# EasyEDA Pro project CameraTargetV1.eprj, board PCB1
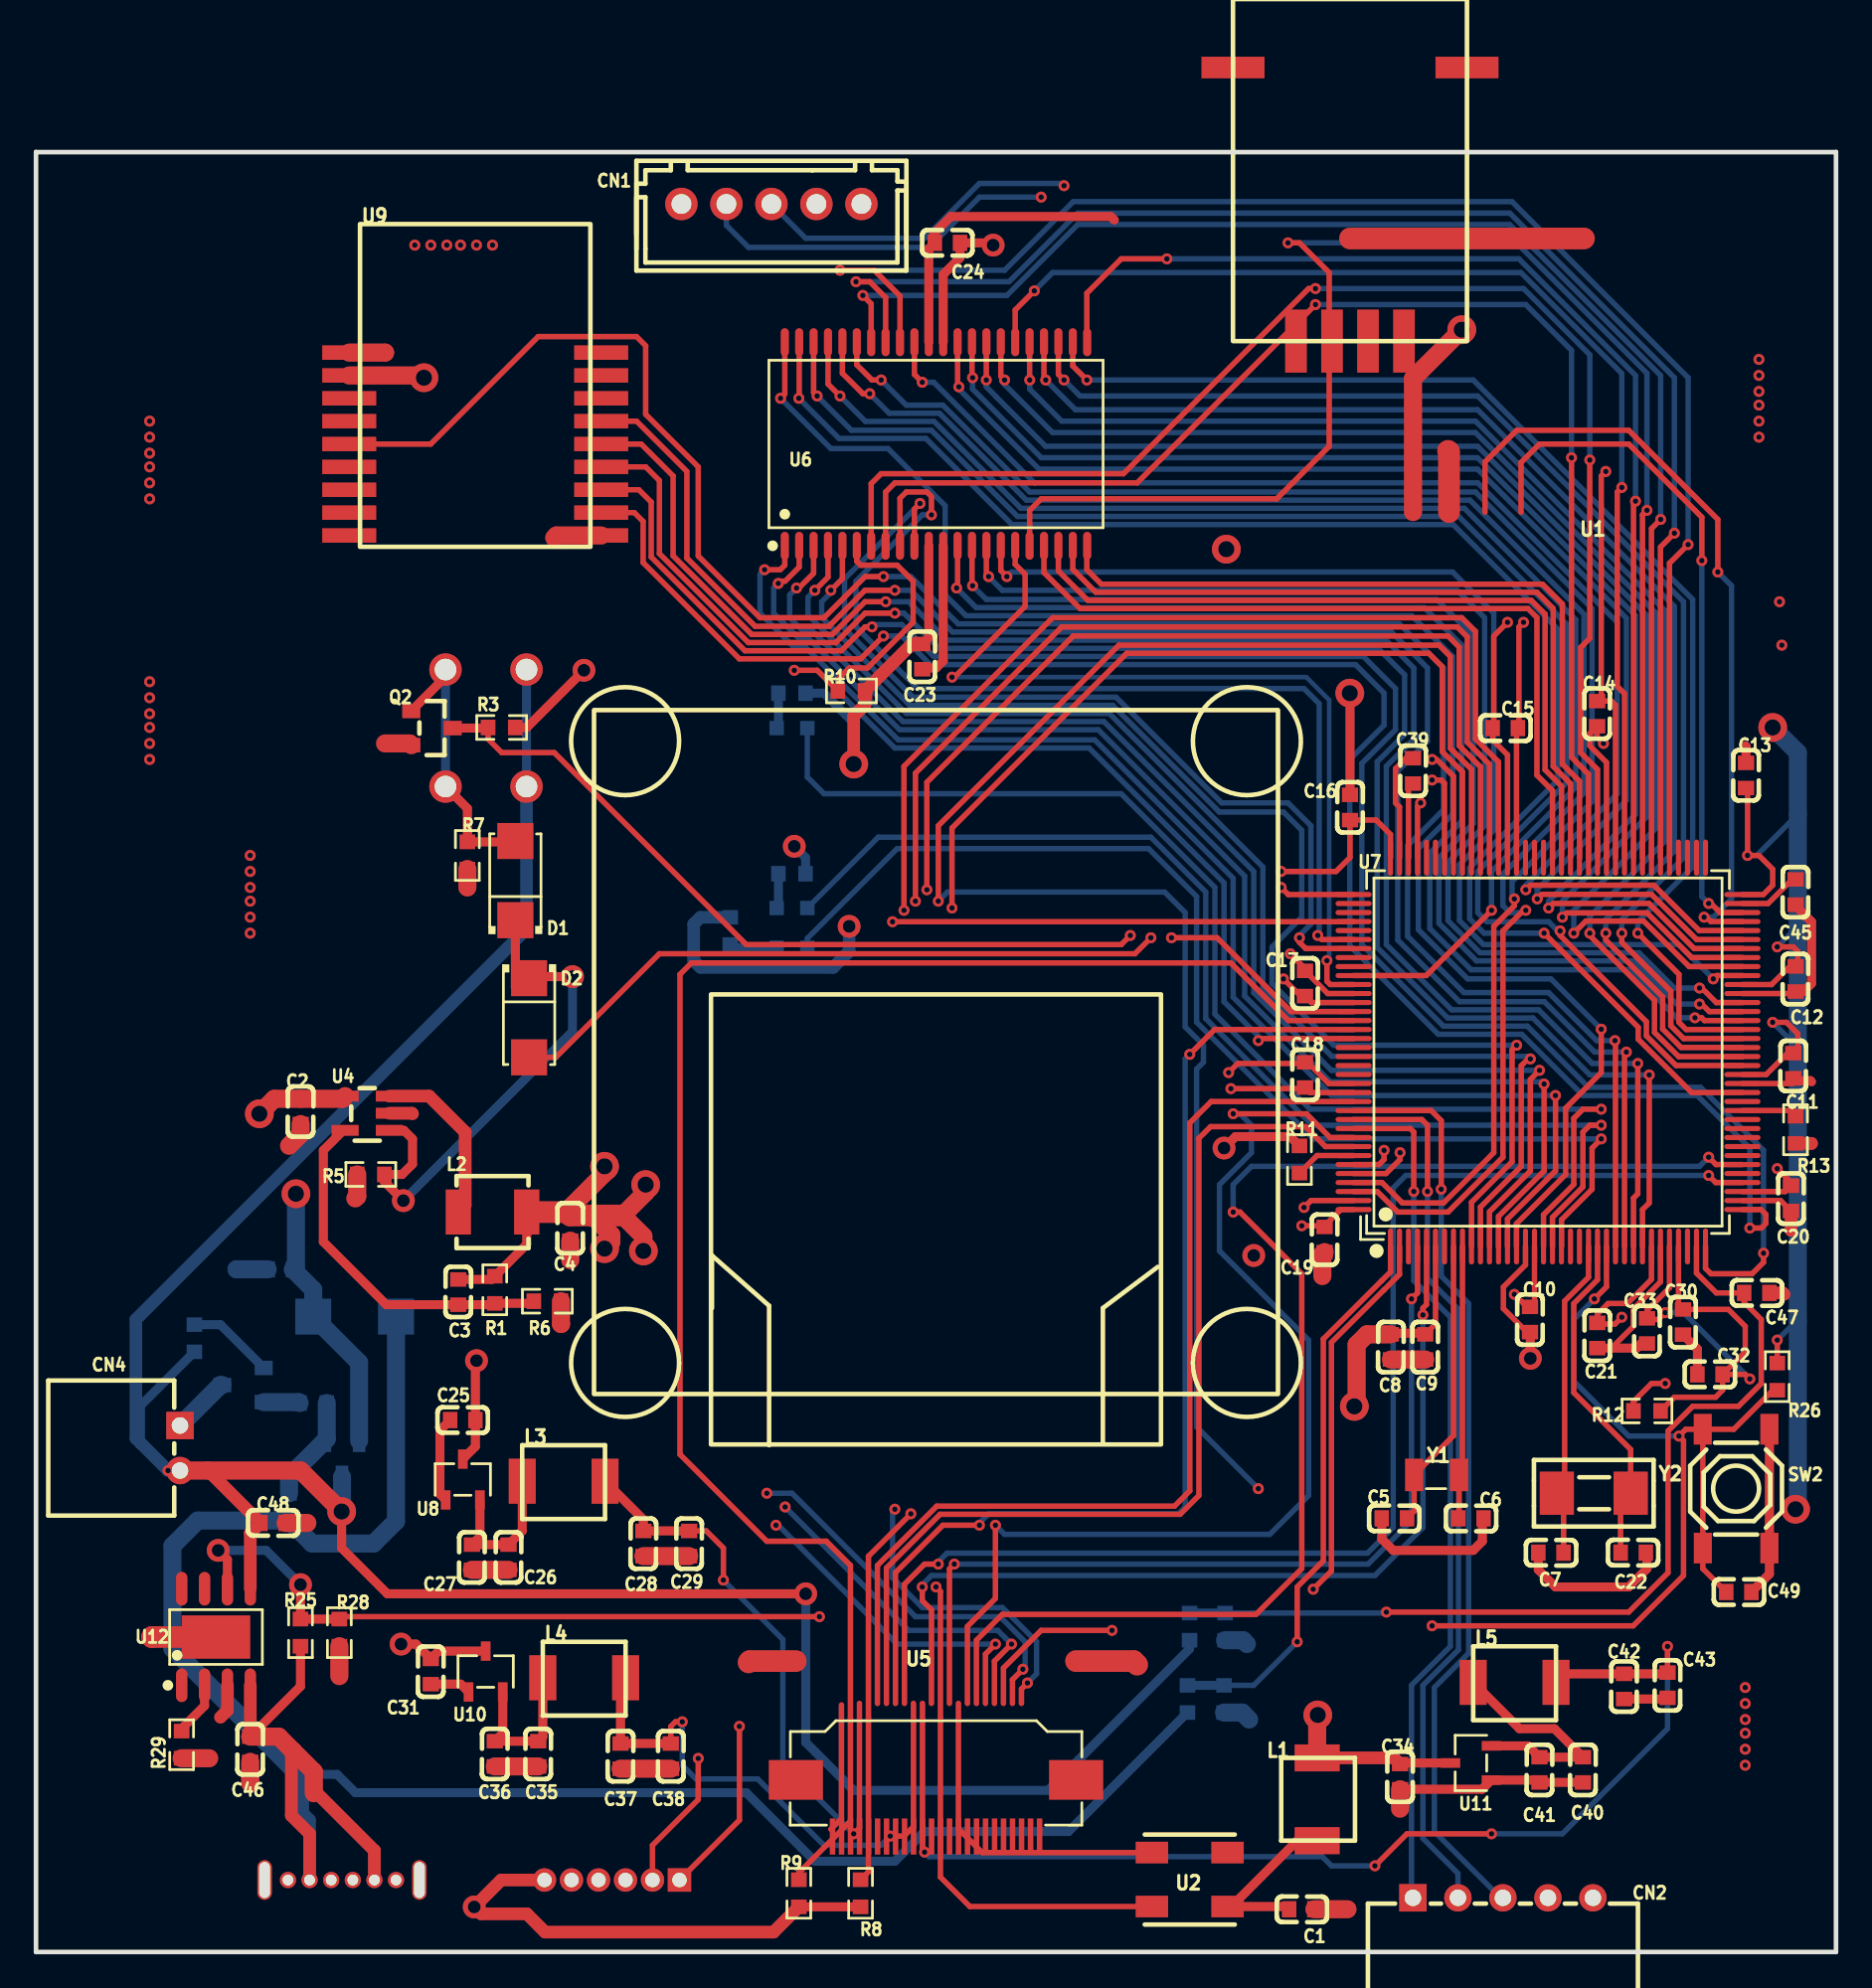
[diagram p1: board, top side]
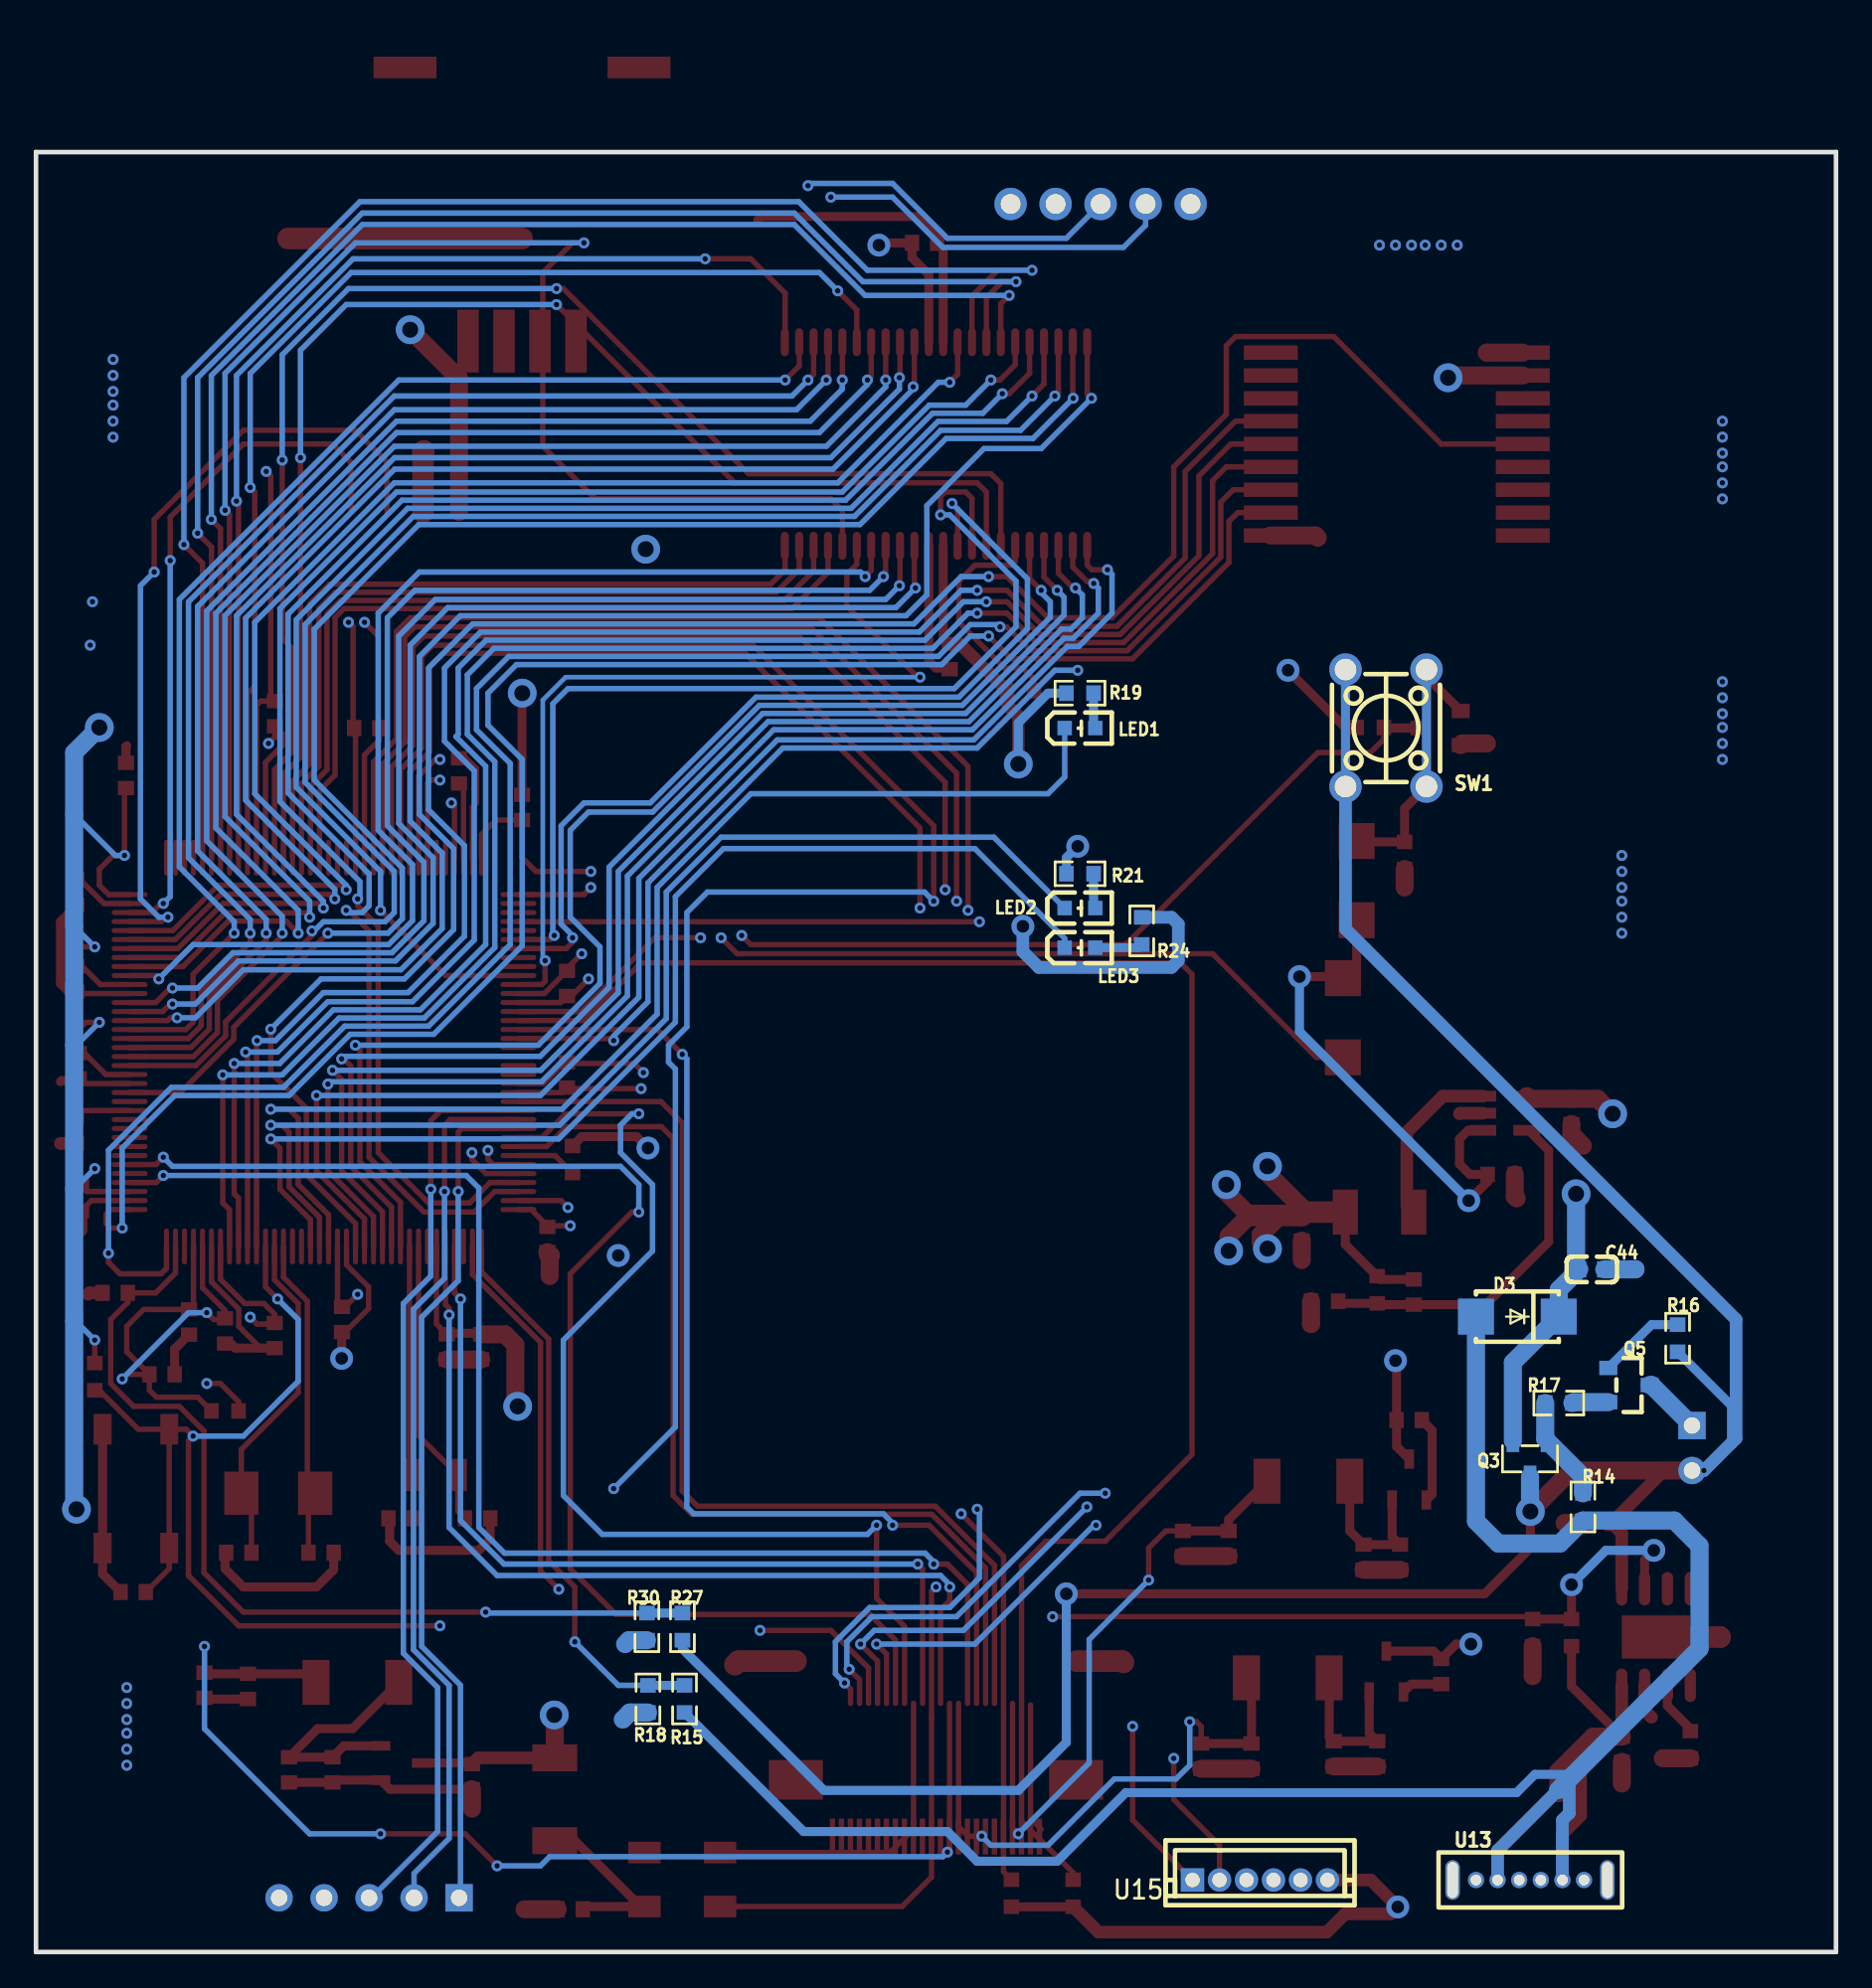
[diagram p2: board, bottom side, seen from below]

Outline 100 x 100 mm; copper layers: Top Layer, CPU1, CPU2, Bottom Layer. Coordinates in mm from the lower left corner of the outline.
Outline path: 0,100 0,0 arc(0,0) 0,0 100,0 arc(100,0) 100,0 100,100 arc(100,100) 100,100 0,100 arc(0,100) 0,100
Stack: Top Layer 0.035mm / Dielectric1 0.48mm PP er 4.5 / CPU1 0.035mm / Dielectric2 0.48mm FR4 er 4.5 / CPU2 0.035mm / Dielectric3 0.48mm PP er 4.5 / Bottom Layer 0.035mm

## Design rules (mm)
spacing safeClearance (default): track to track 0.152, other pairs 0.152 to 0.3
track width trackWidth (default): min 0.127, default 0.254, max 2.54
differential pair differentialPair (default): width min 0.127, default 0.254, max 2.54; gap min 0.152, default 0.152
via viaSize (default): diameter min 0.5, default 0.61, max 10; hole min 0.3, default 0.305, max 6

## Placement (name value [footprint] x y rotation side)
C1  0.1uF  [C0603]  70.32 2.38 180 top
C2  10uF  [C0603]  14.7 46.7 90 top
C3  22pF  [C0603]  23.46 36.67 270 top
C4  10uF  [C0603]  29.68 40.22 90 top
C5  15pF  [C0603]  75.47 24.09 0 top
C6  15pF  [C0603]  79.72 24.09 180 top
C7  22pF  [C0603]  84.16 22.19 180 top
C8  10uF  [C0603]  75.27 33.62 90 top
C9  0.1uF  [C0603]  77.18 33.62 90 top
C10  0.1uF  [C0603]  83 35.14 90 top
C11  0.1uF  [C0603]  97.63 49.24 90 top
C12  0.1uF  [C0603]  97.75 54.06 90 top
C13  0.1uF  [C0603]  95 65.37 270 top
C14  0.1uF  [C0603]  86.73 68.8 270 top
C15  0.1uF  [C0603]  81.63 68 180 top
C16  0.1uF  [C0603]  73 63.59 270 top
C17  0.1uF  [C0603]  70.5 53.81 270 top
C18  0.1uF  [C0603]  70.5 48.73 270 top
C19  0.1uF  [C0603]  71.59 39.59 90 top
C20  0.1uF  [C0603]  97.5 41.87 90 top
C21  0.1uF  [C0603]  86.74 34.25 90 top
C22  22pF  [C0603]  88.74 22.19 0 top
C23  0.1uF  [C0603]  49.24 71.97 90 top
C24  0.1uF  [C0603]  50.64 94.96 0 top
C25  1uF  [C0603]  23.71 29.55 0 top
C26  0.1uF  [C0603]  26.25 21.93 90 top
C27  10uF  [C0603]  24.22 21.93 90 top
C28  10uF  [C0603]  33.74 22.7 90 top
C29  0.1uF  [C0603]  36.28 22.7 90 top
C30  0.1uF  [C0603]  91.5 35 90 top
C31  1uF  [C0603]  21.93 15.58 90 top
C32  10uF  [C0603]  93 32.09 0 top
C33  2.2uF  [C0603]  89.5 34.51 90 top
C34  1uF  [C0603]  75.78 9.74 90 top
C35  0.1uF  [C0603]  27.9 11.01 90 top
C36  10uF  [C0603]  25.49 11.01 90 top
C37  10uF  [C0603]  32.47 10.88 90 top
C38  0.1uF  [C0603]  35.27 10.88 90 top
C39  2.2uF  [C0603]  76.5 65.62 270 top
C40  0.1uF  [C0603]  85.94 10.12 90 top
C41  10uF  [C0603]  83.53 10.12 90 top
C42  10uF  [C0603]  88.23 14.76 90 top
C43  0.1uF  [C0603]  90.64 14.82 90 top
C44  4.7uF  [C0603]  13.57 37.93 0 bottom
C45  2.2uF  [C0603]  97.75 58.89 90 top
C46  1uF  [C0603]  11.9 11.27 90 top
C47  0.1uF  [C0603]  95.6 36.62 180 top
C48  4.7uF  [C0603]  13.17 23.84 180 top
C49  0.1uF  [C0603]  94.6 20 180 top
CN1  灯板连接口 2.54 5p直插  [CONN-TH_5P-P2.50_HX25003-5A]  40.86 97.12 0 top
CN2  HDGC2501WR-5P  [CONN-TH_5P-P2.50_HDGC2501WR-5P]  81.5 3.01 0 top
CN4  HDGC2501WR-2P  [CONN-TH_2P-P2.50_HDGC2501WR-2P]  8 28 270 top
D1  SS14A  [SMA_L4.3-W2.6-LS5.2-RD]  26.63 59.53 90 top
D2  SS14A  [SMA_L4.3-W2.6-LS5.2-RD]  27.39 51.91 270 top
D3  -  [DO-214AC_L4.3-W2.7-LS5.3-RD]  17.7 35.3 0 bottom
L1  -  [0420]  69.18 6.19 90 top
L2  2.2uH  [IND-SMD_L4.0-W4.0_0.47UH04209.5A]  25.36 41.11 0 top
L3  -  [0420]  27.01 28.16 0 top
L4  -  [0420]  28.16 17.23 0 top
L5  -  [0420]  79.85 16.98 0 top
LED1  TLMG1100-GS08  [LED0603-R-RD_GREEN]  42 68 180 bottom
LED2  TLMG1100-GS08  [LED0603-R-RD_GREEN]  42 58 180 bottom
LED3  TLMS1000-GS08  [LED0603-R-RD]  42 55.8 180 bottom
Q2  AO3400  [SOT-23_L2.9-W1.3-P1.90-LS2.4-BR]  22 68 180 top
Q3  -  [SOT-23-3_L2.9-W1.3-P1.90-LS2.4-BR]  17 27.4 90 bottom
Q5  AO3400  [SOT-23_L2.9-W1.3-P1.90-LS2.4-BR]  11.5 31.5 0 bottom
R1  453kΩ  [R0603]  25.49 36.79 90 top
R3  100kΩ  [R0603]  25.87 68.03 0 top
R5  100kΩ  [R0603]  18.6 43.2 0 top
R6  100kΩ  [R0603]  28.41 36.16 180 top
R7  10kΩ  [R0603]  23.97 60.92 270 top
R8  4.7kΩ  [R0603]  45.81 3.26 270 top
R9  4.7kΩ  [R0603]  42.38 3.26 270 top
R10  10kΩ  [R0603]  45.3 70.07 0 top
R11  10kΩ  [R0603]  70.19 44.03 270 top
R12  10Ω  [R0603]  89.5 30.06 180 top
R13  10kΩ  [R0603]  97.75 45.68 270 top
R14  1kΩ  [R0603]  14.06 24.73 270 bottom
R15  20kΩ  [R0603]  63.97 14.06 270 bottom
R16  10kΩ  [R0603]  8.8 34.1 270 bottom
R17  10kΩ  [R0603]  15.4 30.5 0 bottom
R18  30kΩ  [R0603]  66 14.06 90 bottom
R19  1kΩ  [R0603]  42 69.94 0 bottom
R21  1kΩ  [R0603]  42 59.91 0 bottom
R24  1kΩ  [R0603]  38.57 56.73 90 bottom
R25  20kΩ  [R0603]  14.69 17.74 270 top
R26  10kΩ  [R0603]  96.74 31.97 270 top
R27  300kΩ  [R0603]  64.09 18.08 270 bottom
R28  30kΩ  [R0603]  16.85 17.74 90 top
R29  3kΩ  [R0603]  8.09 11.52 90 top
R30  100kΩ  [R0603]  66.06 18.08 90 bottom
SW1  -  [按钮开关]  25 68 270 bottom
SW2  1TS001G-2700-1500-CT  [SW-SMD_4P-L5.1-W5.1-P3.70-LS6.5-TL-2]  94.45 25.74 90 top
U1  -  [GC2400-TC010R]  73 99 0 top
U2  -  [5032-4P]  64.1 4.03 180 top
U4  -  [PW2051]  18.4 46.6 0 top
U5  -  [OV2640]  50 16.2 0 top
U6  IS62WV51216BLL-55TLI  [TSOP-44_L18.4-W10.2-P0.80-LS11.8-BL]  50 83.78 0 top
U7  STM32F407ZGT6  [LQFP-144_L20.0-W20.0-P0.50-LS22.0-BL]  84 50 0 top
U8  -  [SOT-23-3_L2.9-W1.6-P1.90-LS2.9-BL]  23.71 26.25 0 top
U9  -  [XY-MBA32A]  18 96 0 top
U10  -  [SOT-23-3_L2.9-W1.6-P1.90-LS2.9-BL]  24.98 15.58 0 top
U11  -  [SOT-23-3_L2.9-W1.6-P1.90-LS2.9-BL]  79.72 10.5 90 top
U12  -  [PW4056]  10 17.5 0 top
U13  -  [typec]  17 4 180 bottom
U15  HDGC1501WV-6P  [CONN-TH_6P-P1.50_HDGC_HDGC1501WV-6P]  32 4 180 bottom
Y1  -  [3215]  77.81 26.51 180 top
Y2  -  [5032]  86.5 25.49 180 top

## Footprints (pads in the part's own frame, mm; a bottom-side part is the same pattern mirrored in y, then rotated)
0420
  rect 1.5x2.5 smd: 1(0,-2) 2(4.6,-2)
3215
  rect 1x1.8 smd: 1(-1.25,0) 2(1.25,0)
5032
  rect 1.9x2.401 smd: 1(-2.093,0) 2(2.007,0)
5032-4P
  rect 1.8x1.2 smd: 1(-2.1,-1.5) 2(2.1,-1.5) 3(2.1,1.5) 4(-2.1,1.5)
C0603
  rect 0.8x0.899 smd: 1(-0.701,0) 2(0.701,0)
CONN-TH_2P-P2.50_HDGC2501WR-2P
  rect 1.524x1.524 hole 0.914: 1(-1.25,0)
  round 1.524 hole 0.914: 2(1.25,0)
CONN-TH_5P-P2.50_HDGC2501WR-5P
  rect 1.524x1.524 hole 0.914: 1(-5,0)
  round 1.524 hole 0.914: 2(-2.5,0) 3(0,0) 4(2.5,0) 5(5,0)
CONN-TH_5P-P2.50_HX25003-5A
  round 1.8 hole 1.1: 1(-5,0) 2(-2.5,0) 3(0,0) 4(2.5,0) 5(5,0)
CONN-TH_6P-P1.50_HDGC_HDGC1501WV-6P
  rect 1.3x1.3 hole 0.8: 1(-3.75,0)
  round 1.3 hole 0.8: 2(-2.25,0) 3(-0.75,0) 4(0.75,0) 5(2.25,0) 6(3.75,0)
DO-214AC_L4.3-W2.7-LS5.3-RD
  rect 1.999x1.999 smd: 1(-2.299,0) 2(2.301,0)
GC2400-TC010R
  rect 1.2x3.5 smd: 2(-3,-9.5) 3(-1,-9.5) 4(1,-9.5) 5(3,-9.5)
  rect 3.5x1.2 smd: 7(6.5,5.7) 8(-6.5,5.7)
IND-SMD_L4.0-W4.0_0.47UH04209.5A
  rect 1.399x2.499 smd: 1(-1.9,0) 2(1.9,0)
LED0603-R-RD
  rect 0.8x0.8 smd: 1(0.851,0) 2(-0.851,0)
LED0603-R-RD_GREEN
  rect 0.8x0.8 smd: 1(0.851,0) 2(-0.851,0)
LQFP-144_L20.0-W20.0-P0.50-LS22.0-BL
  oval 0.28x2 smd: 1(-8.75,-10.8) 2(-8.25,-10.8) 3(-7.75,-10.8) 4(-7.25,-10.8) 5(-6.75,-10.8) 6(-6.25,-10.8) 7(-5.75,-10.8) 8(-5.25,-10.8) 9(-4.75,-10.8) 10(-4.25,-10.8) 11(-3.75,-10.8) 12(-3.25,-10.8) 13(-2.75,-10.8) 14(-2.25,-10.8) 15(-1.75,-10.8) 16(-1.25,-10.8) 17(-0.75,-10.8) 18(-0.25,-10.8) 19(0.25,-10.8) 20(0.75,-10.8) 21(1.25,-10.8) 22(1.75,-10.8) 23(2.25,-10.8) 24(2.75,-10.8) 25(3.25,-10.8) 26(3.75,-10.8) 27(4.25,-10.8) 28(4.75,-10.8) 29(5.25,-10.8) 30(5.75,-10.8) 31(6.25,-10.8) 32(6.75,-10.8) 33(7.25,-10.8) 34(7.75,-10.8) 35(8.25,-10.8) 36(8.75,-10.8) 73(8.75,10.8) 74(8.25,10.8) 75(7.75,10.8) 76(7.25,10.8) 77(6.75,10.8) 78(6.25,10.8) 79(5.75,10.8) 80(5.25,10.8) 81(4.75,10.8) 82(4.25,10.8) 83(3.75,10.8) 84(3.25,10.8) 85(2.75,10.8) 86(2.25,10.8) 87(1.75,10.8) 88(1.25,10.8) 89(0.75,10.8) 90(0.25,10.8) 91(-0.25,10.8) 92(-0.75,10.8) 93(-1.25,10.8) 94(-1.75,10.8) 95(-2.25,10.8) 96(-2.75,10.8) 97(-3.25,10.8) 98(-3.75,10.8) 99(-4.25,10.8) 100(-4.75,10.8) 101(-5.25,10.8) 102(-5.75,10.8) 103(-6.25,10.8) 104(-6.75,10.8) 105(-7.25,10.8) 106(-7.75,10.8) 107(-8.25,10.8) 108(-8.75,10.8)
  oval 2x0.28 smd: 37(10.8,-8.75) 38(10.8,-8.25) 39(10.8,-7.75) 40(10.8,-7.25) 41(10.8,-6.75) 42(10.8,-6.25) 43(10.8,-5.75) 44(10.8,-5.25) 45(10.8,-4.75) 46(10.8,-4.25) 47(10.8,-3.75) 48(10.8,-3.25) 49(10.8,-2.75) 50(10.8,-2.25) 51(10.8,-1.75) 52(10.8,-1.25) 53(10.8,-0.75) 54(10.8,-0.25) 55(10.8,0.25) 56(10.8,0.75) 57(10.8,1.25) 58(10.8,1.75) 59(10.8,2.25) 60(10.8,2.75) 61(10.8,3.25) 62(10.8,3.75) 63(10.8,4.25) 64(10.8,4.75) 65(10.8,5.25) 66(10.8,5.75) 67(10.8,6.25) 68(10.8,6.75) 69(10.8,7.25) 70(10.8,7.75) 71(10.8,8.25) 72(10.8,8.75) 109(-10.8,8.75) 110(-10.8,8.25) 111(-10.8,7.75) 112(-10.8,7.25) 113(-10.8,6.75) 114(-10.8,6.25) 115(-10.8,5.75) 116(-10.8,5.25) 117(-10.8,4.75) 118(-10.8,4.25) 119(-10.8,3.75) 120(-10.8,3.25) 121(-10.8,2.75) 122(-10.8,2.25) 123(-10.8,1.75) 124(-10.8,1.25) 125(-10.8,0.75) 126(-10.8,0.25) 127(-10.8,-0.25) 128(-10.8,-0.75) 129(-10.8,-1.25) 130(-10.8,-1.75) 131(-10.8,-2.25) 132(-10.8,-2.75) 133(-10.8,-3.25) 134(-10.8,-3.75) 135(-10.8,-4.25) 136(-10.8,-4.75) 137(-10.8,-5.25) 138(-10.8,-5.75) 139(-10.8,-6.25) 140(-10.8,-6.75) 141(-10.8,-7.25) 142(-10.8,-7.75) 143(-10.8,-8.25) 144(-10.8,-8.75)
OV2640
  rect 0.3x2 smd: 1(-5.747,-9.785) 2(-5.247,-9.785) 3(-4.747,-9.785) 4(-4.247,-9.785) 5(-3.747,-9.785) 6(-3.247,-9.785) 7(-2.747,-9.785) 8(-2.247,-9.785) 9(-1.747,-9.785) 10(-1.247,-9.785) 11(-0.747,-9.785) 12(-0.247,-9.785) 13(0.253,-9.785) 14(0.753,-9.785) 15(1.253,-9.785) 16(1.753,-9.785) 17(2.253,-9.785) 18(2.753,-9.785) 19(3.253,-9.785) 20(3.753,-9.785) 21(4.253,-9.785) 22(4.753,-9.785) 23(5.253,-9.785) 24(5.753,-9.785)
  rect 3x2.2 smd: 25(7.785,-6.636) 26(-7.785,-6.636)
PW2051
  rect 1.5x0.6 smd: 1(1.227,-0.95) 2(1.227,0) 3(1.227,0.95) 4(-1.227,0.95) 5(-1.227,-0.95)
PW4056
  oval 0.63x1.865 smd: 1(-1.905,-2.683) 2(-0.635,-2.683) 3(0.635,-2.683) 4(1.905,-2.683) 5(1.905,2.683) 6(0.635,2.683) 7(-0.635,2.683) 8(-1.905,2.683)
  rect 3.8x2.4 smd: 9(0,0)
R0603
  rect 0.807x0.864 smd: 1(-0.754,0) 2(0.754,0)
SMA_L4.3-W2.6-LS5.2-RD
  rect 2x2 smd: 1(-2.2,0) 2(2.2,0)
SOT-23-3_L2.9-W1.3-P1.90-LS2.4-BR
  rect 1.25x0.701 smd: 1(1.001,-0.95) 2(1.001,0.95) 3(-1.001,0)
SOT-23-3_L2.9-W1.6-P1.90-LS2.9-BL
  rect 0.532x1.07 smd: 1(-0.95,-1.135) 2(0.95,-1.135) 3(0,1.135)
SOT-23_L2.9-W1.3-P1.90-LS2.4-BR
  rect 1x0.8 smd: 1(1.15,-0.95) 2(1.15,0.95) 3(-1.15,0)
SW-SMD_4P-L5.1-W5.1-P3.70-LS6.5-TL-2
  rect 1.7x1 smd: 1(-3.3,1.849) 2(3.3,1.851) 3(-3.3,-1.851) 4(3.3,-1.851)
TSOP-44_L18.4-W10.2-P0.80-LS11.8-BL
  oval 0.448x1.551 smd: 1(-8.4,-5.655) 2(-7.6,-5.655) 3(-6.8,-5.655) 4(-6,-5.655) 5(-5.2,-5.655) 6(-4.4,-5.655) 7(-3.6,-5.655) 8(-2.8,-5.655) 9(-2,-5.655) 10(-1.2,-5.655) 11(-0.4,-5.655) 12(0.4,-5.655) 13(1.2,-5.655) 14(2,-5.655) 15(2.8,-5.655) 16(3.6,-5.655) 17(4.4,-5.655) 18(5.2,-5.655) 19(6,-5.655) 20(6.8,-5.655) 21(7.6,-5.655) 22(8.4,-5.655) 23(8.4,5.655) 24(7.6,5.655) 25(6.8,5.655) 26(6,5.655) 27(5.2,5.655) 28(4.4,5.655) 29(3.6,5.655) 30(2.8,5.655) 31(2,5.655) 32(1.2,5.655) 33(0.4,5.655) 34(-0.4,5.655) 35(-1.2,5.655) 36(-2,5.655) 37(-2.8,5.655) 38(-3.6,5.655) 39(-4.4,5.655) 40(-5.2,5.655) 41(-6,5.655) 42(-6.8,5.655) 43(-7.6,5.655) 44(-8.4,5.655)
typec
  round 0.9 hole 0.6: 1(-3,0) 2(-1.8,0) 3(-0.6,0) 4(0.6,0) 5(1.8,0) 6(3,0)
  oval 0.8x2.2 hole 0.6x2: 7(-4.3,0) 8(4.3,0)
XY-MBA32A
  rect 3x0.8 smd: 1(-0.6,-7.14) 2(-0.6,-8.41) 3(-0.6,-9.68) 4(-0.6,-10.95) 5(-0.6,-12.22) 6(-0.6,-13.49) 7(-0.6,-14.76) 8(-0.6,-16.03) 9(-0.6,-17.3) 10(13.4,-17.3) 11(13.4,-16.03) 12(13.4,-14.76) 13(13.4,-13.49) 14(13.4,-12.22) 15(13.4,-10.95) 16(13.4,-9.68) 17(13.4,-8.41) 18(13.4,-7.14)
按钮开关
  round 1.8 hole 1.2: 1(-3.25,2.25) 2(3.25,2.25) 3(-3.25,-2.25) 4(3.25,-2.25)

## Nets
As in the schematic.

Pads without a net: U2 1; U5 1 23 24; U7 3 7 21 22 34 41 43 44 45 46 47 49 73 74 75 76 91 92 93 103 104 110 111 113 116 117 126 127 128 129; U9 3 4 6 7 8 9 16 17 18; U12 1 7 8; U13 3 4 7 8

## Via types
v1: diameter 0.61, hole 0.305, Top Layer to Bottom Layer, 212 vias
v2: diameter 1.27, hole 0.711, Top Layer to Bottom Layer, 15 vias
v3: diameter 1.6, hole 0.9, Top Layer to Bottom Layer, 16 vias

## Routing (per net, layer and track width the routed paths; a pad name or vN(x,y) marks a point on that pad's centre or on a via; arc(x,y) is an arc through that point)
+3.3V: length 835.8
  Top Layer w0.3: U7.52 96.12,48.75 97.31,49.94 97.88,49.94 97.88,51.02 97.24,51.65 v1(96.48,51.65) ; v1(96.74,55.84) 97.63,55.84 97.88,55.59 97.88,54.92 97.72,54.76 ; U7.30 89.75,37.37 88.41,36.03 87.34,36.03 86.74,35.43 C21.2 86.8,34.89 87.72,34.89 v1(88.1,35.27) ; U7.121 70.86,52.75 C17.2 70.26,53.11 v1(69.3,54.06) ; v1(81.75,73.88) 80.99,73.11 80.99,68.06 C15.2 80.93,67.33 81.75,66.51 U7.95 ; v1(87.08,67.15) 86.73,67.5 C14.2 86.32,67.7 86.32,67.02 87.25,66.09 U7.84 ; v1(96.74,43.52) 97.5,42.76 C20.2 97.18,42.25 U7.39 ; v1(70.32,40.35) 71.59,40.35 72.49,41.25 U7.144 ; C13.2 95.09,64.58 v1(95.09,60.92) 95.72,60.92 96.48,60.16 96.48,59.27 95.96,58.75 U7.72 ; C9.2 77.75,34.89 U7.6 ; U7.62 96.42,53.75 97.44,54.76 97.72,54.76 ; 97.88,54.76 97.72,54.76 ; U7.143 70.83,41.75 v1(70.45,41.36) ; U7.17 83.25,36.13 83,35.88 83,35.84 82.83,35.84 v1(82.13,36.54) ; v1(66.38,47.97) 70.56,47.97 70.78,47.75 U7.131 ; v1(69.18,60.03) 72.23,60.03 73,60.81 C16.2 74.45,62.89 75.25,62.09 U7.108 ; R12.2 88.75,30.58 89.75,31.59 v1(90.51,31.59) ; v1(96.74,34) R26.1
  Top Layer w0.5: U6.33 50.4,93.2 51.34,94.13 51.34,94.96 53.05,94.96 v2(53.18,94.83) ; U6.11 49.6,73.03 C23.2 ; 75.4,34.38 77.12,34.38 C9.2 ; C34.2 75.84,10.5 U11.3 ; v2(20.28,17.11) 21.11,17.11 C31.2 22.37,16.72 U10.3 ; R3.2 27.27,68.03 v2(30.44,71.21) ; L2.2 27.26,39.32 R1.2 25.31,37.37 C3.1 ; R9.2 R8.2 ; U8.3 24.41,28.09 C25.2 24.41,32.79 v2(24.47,32.86)
  Top Layer w0.7: C23.2 48.66,72.67 R10.2 46.06,69.3 45.43,68.67 v3(45.43,66) ; U15.6 25.84,4 v2(24.35,2.5) 24.73,2.12 27.27,2.12 28.28,1.11 40.97,1.11 R9.2 ; L1.2 75.44,10.79 C34.2
  Top Layer w1: 30.88,40.92 31.97,39.84 31.97,39.46 v3(31.59,39.08) ; v3(33.87,42.63) 33.87,42.2 32.59,40.92 33.74,39.77 v3(33.74,38.95) ; L1.2 71.18,13.14 v3(71.21,13.17) ; C4.2 29.68,41.36 31.59,43.27 v3(31.59,43.65) ; U9.2 21.43,87.59 v3(21.55,87.47) ; C8.2 73.94,34.32 73.37,33.74 73.37,30.44 v3(73.24,30.32) ; 76.5,80 76.5,87.42 v3(79.21,90.13)
  Top Layer w1.2: L2.2 29.49,41.11 C4.2 32.59,40.92
  CPU1 w0.3: 67.53,43.03 69.19,41.36 v1(70.45,41.36) ; v1(69.3,54.06) 67.91,54.06 66.64,55.33 ; v1(90.51,31.59) 85.94,31.59 84.8,30.44 84.8,30.32 ; 83.38,30.32 85.46,32.4 87.77,32.4 88.1,32.73 v1(88.1,35.27) ; v1(96.86,75.02) 95.67,73.83 95.59,73.83 ; 67.53,41.11 68.29,40.35 v1(70.32,40.35) ; v1(82.13,36.54) 82,36.41 82,33.24 79.21,30.44 79.21,30.32 ; 66.64,60.8 67.4,60.03 v1(69.18,60.03) ; v1(66.38,47.97) 67.02,47.97 67.53,47.46 ; v1(96.99,72.61) 95.59,71.21
  CPU1 w0.5: 30.32,16.22 28.66,17.87 21.04,17.87 v2(20.28,17.11) ; v2(53.18,94.83) 53.68,95.34 54.44,95.34 54.7,95.59 ; v2(42.13,61.43) 43.33,61.43 45.3,59.46 ; 26.51,32.86 25.87,33.49 25.11,33.49 v2(24.47,32.86) ; 36.17,72.98 32.21,72.98 v2(30.44,71.21)
  CPU1 w0.7: v3(45.43,66) 45.43,63.97 45.81,63.59 47.13,63.59 ; v2(24.35,2.5) 24.35,4.79 25.74,6.19
  CPU1 w1: v2(45.17,56.99) 45.17,61.64 46.49,62.95 ; 46.49,62.95 41.11,62.95 33.87,55.72 v3(33.87,42.63) ; 46.49,62.95 47.13,63.59 52.74,63.59 ; v3(79.21,90.13) 82.64,86.7 87.21,86.7 95.59,78.32 95.59,68.92 v3(96.48,68.03) ; v3(31.59,43.65) 31.59,58.64 37.17,64.22 37.17,71.97 33.87,75.27 29.93,75.27 27.68,77.53 27.68,81.47 21.68,87.47 v3(21.55,87.47) ; 52.74,63.59 65.62,63.59 66.64,62.57 66.64,50.25 67.53,49.37 67.53,41.11 ; 52.74,63.59 60.41,71.26 60.41,89.88 53.18,97.12 CN1.5 ; v3(33.74,38.95) 33.74,38.44 28.66,33.36 28.66,30.57 30.44,28.79 33.36,28.79 39.59,22.57 71.84,22.57 73.24,23.97 v3(73.24,30.32) 85.98,30.32 87.88,28.41 89.37,28.41 91.53,26.25 96.1,26.25 v3(97.75,24.6) ; v3(31.59,39.08) 31.59,41.36 29.3,43.65 26.38,43.65 25.62,42.89 25.62,39.71 24.85,38.95 22.57,38.95 21.93,38.32 21.93,35.27 22.82,34.38 26,34.38 26.89,33.49 26.89,29.93 28.92,27.9 28.92,20.28 30.32,18.89 30.32,8.73 28.79,7.2 26.76,7.2 25.74,6.19 25.74,3.65 28.16,1.23 53.68,1.23 60.16,7.71 63.59,7.71 69.05,13.17 v3(71.21,13.17) 76.34,13.17 77.27,12.24 77.27,7.62 79.72,5.17 84.34,5.17 CN2.5
  CPU2 w0.3: v1(96.86,75.02) 92.93,71.08 84.16,71.08 81.75,73.5 v1(81.75,73.88) ; v1(87.08,67.15) 91.66,67.15 96.99,72.48 v1(96.99,72.61)
  Bottom Layer w0.3: v1(96.48,51.65) 97.75,50.38 97.88,50.38 ; v1(96.74,55.84) 97.88,56.99 98.13,56.99 ; v1(95.09,60.92) 95.59,60.92 97.88,63.21 ; v1(96.74,43.52) 98.01,42.25 98.13,42.25 ; v1(96.74,34) 97.79,35.05 97.88,35.05
  Bottom Layer w0.5: v2(42.13,61.43) 42.75,60.8 42.75,60 ; v3(45.43,66) 45.43,68.29 43.78,69.94 R19.2
  Bottom Layer w0.7: v2(45.17,56.99) 45.17,55.59 44.29,54.7 36.92,54.7 36.54,55.08 36.54,57.11 36.91,57.49 R24.2
  Bottom Layer w1: v3(97.75,24.6) 97.88,24.73 97.88,66.64 v3(96.48,68.03)
+3.7V: length 144.3
  Top Layer w0.5: v2(42.76,19.9) 19.52,19.9 16.98,22.44 v3(16.98,24.47)
  Top Layer w0.7: U12.5 11.91,23.27 12.47,23.84 9.56,26.75
  Top Layer w1: CN4.2 14.7,26.75 v3(16.98,24.47)
  Bottom Layer w0.5: v2(42.76,19.9) 42.76,11.65 45.43,8.98 56.22,8.98 64.09,16.84 R27.2 ; R16.2 5.8,30.35 5.8,28.28 ; SW1.3 SW1.4
  Bottom Layer w0.7: CN4.2 v1(7.34,26.75) 5.55,28.54 5.55,35.14 27.25,56.84 SW1.4
  Bottom Layer w1: Q3.3 17,24.49 v3(16.98,24.47)
AVDD: length 34.7
  Top Layer w0.3: 36.28,23.4 37.24,23.4 38.19,22.44 v1(38.19,20.66) ; v1(45.43,6.57) 45.75,6.89 45.75,13.81
  Top Layer w0.5: L3.2 33.74,24.03 33.74,23.4 36.28,23.4
  Bottom Layer w0.3: v1(45.43,6.57) 41.49,10.5 41.49,17.36 v1(38.19,20.66)
DVDD: length 32.6
  Top Layer w0.3: v1(35.9,12.79) 35.52,12.79 35.27,12.54 C38.2 ; v1(47.46,6.44) 48.22,6.44 48.75,6.96 48.75,13.81
  Top Layer w0.5: L4.2 32.47,14.95 C37.2 C38.2
  Bottom Layer w0.3: v1(35.9,12.79) 35.9,10.38 36.67,9.61 40.09,9.61 43.78,5.93 46.95,5.93 v1(47.46,6.44)
GND: length 302
  Top Layer w0.3: 97.88,48.54 97.59,48.25 U7.51 ; 82.83,34.44 81.52,35.75 81.52,36.95 82.75,38.17 U7.16 ; v1(87.21,82.26) 86.96,82 86.96,69.5 87.52,69.5 87.75,69.27 U7.83 ; C20.1 96.92,41.75 U7.38 ; U2.2 52.56,5.53 51.25,6.84 51.25,13.81 ; 44.16,6.82 44.75,7.41 44.75,13.72 ; U7.31 90.25,37.23 88.74,35.72 88.74,34.76 87.53,33.55 ; C39.1 76.1,66.32 75.53,65.75 75.53,63.84 75.75,63.62 U7.107 ; U7.120 71.76,53.25 70.5,54.51 C17.1 70.5,54.65 v1(69.69,55.46) ; v1(82.64,73.88) 82.39,73.62 82.39,68.19 82.2,68 82.25,67.95 U7.94 ; v1(66.26,48.86) 66.76,49.37 70.7,49.37 71.82,48.25 U7.130 ; 97.83,53.25 U7.61
  Top Layer w0.5: 80.42,24.09 80.35,24.03 80.35,22.82 79.85,22.31 75.4,22.31 74.77,22.95 74.77,24.09 ; C21.1 88.92,33.55 89.18,33.81 C33.1 ; C13.1 95,66.98 94.96,67.02 ; C31.1 23.6,14.88 24.03,14.45 ; C45.1 97.72,58.16 98.64,57.24 98.64,53.81 98.2,53.36 97.88,53.36 ; R11.1 69.68,45.3 66.64,45.3 v2(66,44.67) ; C22.2 89.5,22.13 89.5,21.3 88.48,20.28 84.42,20.28 83.46,21.24 C7.2 ; U6.34 49.6,94.62 C24.1 ; C11.1 97.75,48.41 98.58,48.41 98.64,48.35 ; C49.1 96.3,21 SW2.4 ; 75.78,9.04 80.34,9.04 U11.1 83.4,9.55 C41.1 C40.1 ; C23.1 49.3,71.34 50,71.34 50.4,71.74 U6.12 ; v2(83.02,32.98) 83.02,34.42 C10.1 ; C30.1 92.3,33.5 C32.1 ; C42.1 90.58,14.06 C43.1 ; U8.1 22.44,25.44 22.44,28.98 C25.1 ; 49.87,95.47 50.83,96.42 59.71,96.42 59.91,96.23 ; C16.1 73,69.93 v3(72.99,69.94)
  Top Layer w0.7: C20.1 97.5,40.09 ; 10.25,13.04 10.64,13.43 U12.3 ; 98.64,44.92 98.63,44.93 R13.2 ; C47.1 97.04,36.62 97.12,36.54 ; 20.92,46.57 20.89,46.6 U4.2
  Top Layer w1: 71.46,37.55 71.46,38.64 71.4,38.7 C19.1 ; C36.1 C35.1 ; 9.62,10.76 R29.1 ; R6.1 29.16,34.89 29.17,34.89 ; C46.1 11.9,9.36 ; R7.2 23.97,59.14 ; C8.1 C9.1 ; 19.39,67.15 20.76,67.15 Q2.2 ; 14.06,44.79 14.7,45.43 C2.1 ; C1.1 72.86,2.38 ; U9.10 28.92,78.7 28.79,78.58 ; 75.78,9.04 75.78,7.96 ; C27.1 C26.1 ; U9.1 19.39,88.86 19.39,88.86 ; R28.1 16.85,15.33 ; R5.1 17.85,41.98 17.74,41.87 ; C48.1 15.08,23.84 ; C4.1 29.68,38.44 ; C37.1 C38.1 ; C28.1 C29.1
  Top Layer w1.2: 61.18,15.96 60.98,16.16 57.78,16.16 ; 73,95.2 86,95.2 ; 78.5,80 78.5,83.35 78.45,83.4 ; U12.9 6.45,17.5 6.44,17.49 ; 42.21,16.16 39.66,16.16 39.59,16.09
  CPU1 w1: v3(72.99,69.94) 72.99,71.08 v3(66.13,77.94)
  CPU2 w0.254: v1(66.26,48.86) 65.75,48.35 65.75,44.92 v2(66,44.67) ; v1(82.64,73.88) 87.21,78.45 v1(87.21,82.26)
  CPU2 w0.5: v2(66,44.67) 65.49,44.16 65.49,40.86 v2(67.65,38.7)
  Bottom Layer w1: 11.14,37.94 11.15,37.93 C44.1 ; 67.4,12.92 67.01,13.3 R18.1 ; R17.1 14.6,30.55 Q5.2 ; R30.1 67.06,17.32 67.27,17.11
  vias: v1(6.31,85.05) v1(6.31,84.16) v1(6.31,83.27) v1(6.31,82.51) v1(6.31,81.62) v1(6.31,80.73) v1(6.31,70.57) v1(6.31,69.69) v1(6.31,68.8) v1(6.31,68.03) v1(6.31,67.15) v1(6.31,66.26) v1(11.9,60.92) v1(11.9,60.03) v1(11.9,59.14) v1(11.9,58.38) v1(11.9,57.49) v1(11.9,56.6) v1(21.04,94.83) v1(21.93,94.83) v1(22.82,94.83) v1(23.58,94.83) v1(24.47,94.83) v1(25.36,94.83) v1(94.96,14.69) v1(94.96,13.81) v1(94.96,12.92) v1(94.96,12.15) v1(94.96,11.27) v1(94.96,10.38) v1(95.72,88.48) v1(95.72,87.59) v1(95.72,86.7) v1(95.72,85.94) v1(95.72,85.05) v1(95.72,84.16)
VIN: length 25.8
  Top Layer w1: v3(12.41,46.57) 13.24,47.4 C2.2 17.02,47.4 U4.4
  CPU1 w1: v3(12.41,46.57) 12.41,44.16 v3(14.44,42.13)
  Bottom Layer w1: v3(14.44,42.13) 14.44,38.09 C44.2 15.4,36.8 D3.1 17.95,32.75 Q3.2
ADC_BAT: length 51.7
  Top Layer w0.3: v1(75.02,18.89) 88.48,18.89 90.67,21.07 90.67,28.95 92.04,30.32 94.58,30.32 95.85,31.59 95.85,35.14 94.9,36.09 C47.2 93.35,36.62 92.25,37.72 U7.35
  Bottom Layer w0.3: R30.2 74.97,18.83 v1(75.02,18.89)
  Bottom Layer w0.5: R27.1 R30.2
BAT_CHRG: length 31.2
  Top Layer w0.3: U7.1 75.25,37.79 74.77,37.3 74.76,37.3 71.52,34.06 71.52,21.73 70.07,20.28 v1(70.07,17.23)
  Bottom Layer w0.3: R18.2 67.65,14.81 v1(70.07,17.23)
  Bottom Layer w0.5: R15.1 R18.2
BAT_DONE: length 87.6
  Top Layer w0.3: U7.2 75.75,37.65 74.9,36.79 74.89,36.79 71.97,33.87 71.97,21.17 v1(70.96,20.16) ; R28.2 16.99,18.63 v1(43.52,18.63)
  Top Layer w0.5: v2(14.69,20.41) R25.1 R28.2 ; v2(10.12,22.31) 10.64,21.8 U12.6
  CPU1 w0.3: v1(43.52,18.63) 44.54,19.65 70.45,19.65 v1(70.96,20.16)
  Bottom Layer w0.5: v2(14.69,20.41) 12.79,22.31 v2(10.12,22.31)
BLE_BRTS: length 98
  Top Layer w0.3: U9.15 33.37,85.05 36.16,82.26 36.16,77.45 39.95,73.65 44.05,73.65 46.05,75.65 v1(47.71,75.65) ; U7.27 88.25,49.9 v1(88.35,50)
  Bottom Layer w0.3: v1(47.71,75.65) 48.6,75.65 50.92,73.34 75.3,73.34 77.31,71.34 77.31,67.27 75.65,65.62 75.65,56.22 79.08,52.8 83.79,52.8 86.59,50 v1(88.35,50)
BLE_CDS: length 96.7
  Top Layer w0.3: v1(47.71,74.38) 46.06,74.38 44.43,72.75 39.58,72.75 34.63,77.69 34.63,81.75 33.87,82.51 U9.13 ; v1(89.62,48.73) 89.62,41.62 89.25,41.24 U7.29
  Bottom Layer w0.3: v1(89.62,48.73) 86.33,48.73 83.16,51.89 78.43,51.89 74.51,55.81 74.51,66.13 76.04,67.65 76.04,70.96 74.56,72.43 50.17,72.43 48.22,74.38 v1(47.71,74.38)
BLE_LINK: length 97.5
  Top Layer w0.3: v1(88.99,49.37) 88.99,42.13 88.75,41.89 U7.28 ; v1(47.21,75.02) 46.06,75.02 44.24,73.2 39.76,73.2 35.4,77.57 35.4,82 33.62,83.78 U9.14
  Bottom Layer w0.3: v1(88.99,49.37) 86.46,49.37 83.48,52.35 78.65,52.35 75.02,55.97 75.02,65.88 76.67,67.53 76.54,67.65 76.54,71.34 75,72.88 50.61,72.88 48.48,75.02 v1(47.21,75.02)
BLE_RST: length 119
  Top Layer w0.3: U7.26 87.75,39.2 87.75,50.61 v1(87.72,50.64) ; U9.5 21.93,83.78 27.9,89.75 33.36,89.75 33.87,89.24 33.87,85.43 36.79,82.51 36.79,77.56 40.22,74.13 43.78,74.13 46.06,76.42 v1(47.08,76.42)
  Bottom Layer w0.3: v1(87.72,50.64) 86.7,50.64 84.04,53.3 79.33,53.3 76.2,56.44 76.2,61.47 78.19,63.46 78.19,71.34 75.74,73.79 51.23,73.79 48.6,76.42 v1(47.08,76.42)
DCMI_D0: length 165.6
  Top Layer w0.3: v1(48.22,57.87) 48.22,65.88 56.48,74.13 79.21,74.13 79.97,73.37 79.97,67.4 81.25,66.12 U7.96 ; 53.25,13.81 53.25,16.16 v1(54.19,17.11)
  CPU2 w0.3: v1(41.62,24.73) 37.43,24.73 34.25,27.9 31.83,27.9 28.41,31.33 20.54,31.33 17.87,34 17.87,39.08 16.73,40.22 13.39,40.22 10,43.62 10,47.71 14.44,52.16 29.81,52.16 33.49,55.84 47.33,55.84 48.22,56.73 v1(48.22,57.87)
  Bottom Layer w0.3: v1(41.62,24.73) 48.48,17.87 53.43,17.87 v1(54.19,17.11)
DCMI_D1: length 163.6
  Top Layer w0.3: v1(54.83,15.71) 54.25,15.13 54.25,13.81 ; v1(48.86,58.38) 48.86,65.49 56.99,73.62 78.96,73.62 79.52,73.06 79.52,67.21 80.75,65.98 U7.97
  CPU2 w0.3: v1(40.6,25.49) 37.68,25.49 34.76,28.41 31.97,28.41 28.54,31.84 20.79,31.84 18.38,34.25 18.38,39.59 17.22,40.75 13.92,40.75 10.63,44.03 10.63,47.46 14.69,51.52 30.32,51.52 34.13,55.33 47.59,55.33 48.86,56.6 v1(48.86,58.38)
  Bottom Layer w0.3: v1(40.6,25.49) 42,25.49 48.86,18.63 53.56,18.63 54.95,17.23 54.95,15.84 v1(54.83,15.71)
DCMI_D2: length 137.5
  Top Layer w0.3: U7.98 80.25,65.84 79.07,67.02 79.07,72.5 78.45,73.11 57.62,73.11 49.49,64.99 v1(49.49,59.02) ; v1(55.08,14.95) 54.75,14.62 54.75,13.81
  CPU2 w0.3: v1(49.49,59.02) 49.49,58 50.51,56.99 57.37,56.99 59.27,55.08 64.73,55.08 66.64,53.18 66.64,50.89 64.22,48.48 64.22,23.46 63.21,22.44 49.37,22.44 47.71,24.09 v1(47.71,24.6)
  Bottom Layer w0.3: v1(47.71,24.6) 47.59,24.47 47.59,20.79 49.24,19.14 53.69,19.14 55.59,17.24 55.59,15.46 v1(55.08,14.95)
DCMI_D3: length 118.1
  Top Layer w0.3: U7.99 79.75,65.7 78.58,66.88 78.58,71.97 77.94,72.61 60.16,72.61 50.13,62.57 v1(50.13,58.38) ; v1(59.78,17.87) 55.84,17.87 53.75,15.77 53.75,13.81
  CPU2 w0.3: v1(59.78,17.87) 61.3,17.87 67.91,24.47 v1(67.91,25.74)
  Bottom Layer w0.3: v1(67.91,25.74) 64.48,29.17 64.48,49.06 64.86,49.44 64.86,50.38 63.84,51.4 63.84,57.75 62.7,58.89 50.64,58.89 v1(50.13,58.38)
DCMI_D4: length 142.3
  Top Layer w0.3: U7.112 73.19,57.24 v1(47.59,57.24) ; v1(53.3,17.11) 52.75,16.55 52.75,13.81
  CPU2 w0.3: v1(41.11,23.71) 40.6,24.22 30.82,24.22 30.19,24.85 30.19,28.79 28.1,30.88 20.29,30.88 17.23,33.93 17.23,38.82 16.35,39.71 12.76,39.71 9.11,43.36 9.11,47.97 16.6,55.46 29.93,55.46 37.05,62.57 44.92,62.57 47.08,60.41 47.08,57.75 v1(47.59,57.24)
  Bottom Layer w0.3: v1(53.3,17.11) 47.84,17.11 41.24,23.71 v1(41.11,23.71)
DCMI_D5: length 60.9
  Top Layer w0.3: v1(66.51,46.57) 70.57,46.57 71.9,45.25 U7.136 ; 51.75,13.81 51.75,18.09 53.3,19.65 v1(53.3,23.71)
  Bottom Layer w0.3: v1(66.51,46.57) 66.89,46.57 67.53,45.94 67.53,44.41 65.75,42.63 65.75,38.95 70.7,34 70.7,25.36 68.54,23.2 53.81,23.2 v1(53.3,23.71)
DCMI_D6: length 49.6
  Top Layer w0.3: v1(51.02,21.55) 50.75,21.28 50.75,13.81 ; U7.4 76.75,36.62 v1(76.42,36.28)
  Bottom Layer w0.3: v1(51.02,21.55) 74,21.55 76.42,23.97 v1(76.42,36.28)
DCMI_D7: length 51.6
  Top Layer w0.3: v1(49.24,20.28) 49.24,19.52 49.75,19.01 49.75,13.81 ; v1(77.05,35.4) 77.05,35.78 77.25,35.98 U7.5
  Bottom Layer w0.3: v1(49.24,20.28) 49.24,20.41 49.75,20.92 74.38,20.92 77.05,23.58 v1(77.05,35.4)
DCMI_HSYNC: length 73.9
  Top Layer w0.3: v1(50.13,21.55) 49.37,21.55 48.25,20.43 48.25,13.81 ; v1(92.93,43.14) 93.32,42.75 U7.40
  Bottom Layer w0.3: v1(92.93,43.14) 76.09,43.14 75.4,42.45 75.4,23.59 73.97,22.16 50.61,22.16 50.13,21.68 v1(50.13,21.55)
DCMI_PXCLK: length 75.5
  Top Layer w0.3: v1(66.51,41.11) 66.89,41.11 70.32,37.68 70.32,21.3 67.78,18.76 53.68,18.76 52.25,17.32 52.25,13.81 ; v1(92.93,44.16) 93.33,43.75 U7.42
  Bottom Layer w0.3: v1(66.51,41.11) 66.51,42.63 67.53,43.65 92.42,43.65 v1(92.93,44.16)
DCMI_VSYNC: length 55.7
  Top Layer w0.3: 47.25,13.81 47.25,21.34 50.23,24.32 63.56,24.32 64.61,25.36 64.61,45.21 65.25,45.85 70.53,45.85 71.63,44.75 U7.137
DOVDD: length 65.5
  Top Layer w0.3: v1(74.38,4.79) 76.16,6.57 v1(80.86,6.57) ; 49.25,13.81 49.25,5.67 v1(49.37,5.55) ; v1(90.64,16.98) C43.2
  Top Layer w0.5: C43.2 90.58,15.46 C42.2 84.92,15.46 L5.2
  Bottom Layer w0.3: v1(90.64,16.98) 90.64,12.41 84.8,6.57 v1(80.86,6.57) ; v1(49.37,5.55) 49.62,5.3 71.46,5.3 71.97,4.79 v1(74.38,4.79)
FSMC_A0: length 72.4
  Top Layer w0.3: U7.10 79.75,41.65 82,43.9 82,50.13 v1(82.26,50.38) ; U6.5 44.8,76.3 v1(44.16,75.65)
  Bottom Layer w0.3: v1(44.16,75.65) 44.16,75.53 43.65,75.02 43.65,74.15 48.54,69.26 59.81,69.26 65.74,63.34 69.3,63.34 70.32,62.32 70.32,57.49 68.67,55.84 68.67,53.81 72.1,50.38 v1(82.26,50.38)
FSMC_A1: length 70.3
  Top Layer w0.3: v1(43.27,75.65) 44,76.39 U6.4 ; U7.11 80.25,41.39 82.51,43.65 82.51,49.24 82.96,49.68 v1(83.02,49.62)
  Bottom Layer w0.3: v1(43.27,75.65) 42.89,75.27 42.89,74.28 48.35,68.81 59.63,68.81 68.16,60.28 68.16,53.59 71.99,49.76 82.88,49.76 v1(83.02,49.62)
FSMC_A2: length 71.6
  Top Layer w0.3: v1(42.25,75.78) 42.38,75.78 43.2,76.6 U6.3 ; v1(83.53,48.98) 83.02,48.48 83.02,43.4 80.75,41.13 U7.12
  Bottom Layer w0.3: v1(83.53,48.98) 71.96,48.98 67.65,53.29 67.65,60.03 59.33,68.36 48.17,68.36 43.03,73.5 42.51,73.5 41.87,74.13 41.87,75.4 v1(42.25,75.78)
FSMC_A3: length 72.1
  Top Layer w0.3: v1(41.24,76.04) 41.36,76.16 41.62,76.16 42.4,76.94 U6.2 ; U7.13 81.25,40.87 83.78,43.4 v1(83.78,48.22)
  Bottom Layer w0.3: v1(41.24,76.04) 40.98,75.78 40.98,74.38 42.38,72.99 42.9,72.99 47.98,67.91 59.02,67.91 67.15,59.78 67.15,53.12 71.91,48.35 83.66,48.35 v1(83.78,48.22)
FSMC_A4: length 73.5
  Top Layer w0.3: v1(40.48,76.8) 41.35,76.8 41.6,77.05 U6.1 ; v1(84.42,47.59) 84.42,43.4 81.75,40.73 U7.14
  Bottom Layer w0.3: v1(84.42,47.59) 71.97,47.59 66.51,53.05 66.51,59.65 58.82,67.34 47.9,67.34 42.71,72.53 42.07,72.53 40.22,74.38 40.22,76.54 v1(40.48,76.8)
FSMC_A5: length 91.8
  Top Layer w0.3: U6.44 41.6,86.56 v1(41.36,86.32) ; v1(86.96,51.27) 86.96,48.86 84.98,46.88 84.98,43.2 82.25,40.47 U7.15
  Bottom Layer w0.3: v1(86.96,51.27) 84.16,54.06 79.54,54.06 76.8,56.8 76.8,61.3 78.7,63.21 78.7,71.97 76.43,74.24 51.67,74.24 50.51,75.4 50.51,80.35 47.33,83.53 44.16,83.53 v1(41.36,86.32)
FSMC_A6: length 88.3
  Top Layer w0.3: U7.50 91.98,47.75 89.01,50.71 89.01,51.37 v1(83.78,56.6) ; U6.43 42.4,86.34 v1(42.38,86.32)
  Bottom Layer w0.3: v1(83.78,56.6) 80.45,56.6 79.65,57.4 79.65,60.22 84.54,65.12 84.54,73.5 78.73,79.31 54.22,79.31 49.44,84.09 44.61,84.09 v1(42.38,86.32)
FSMC_A7: length 86.9
  Top Layer w0.3: U7.53 91.12,49.25 89.47,50.9 89.47,51.68 84.67,56.48 v1(84.67,56.73) ; U6.42 43.2,86.65 v1(43.4,86.45)
  Bottom Layer w0.3: v1(84.67,56.73) 84.54,56.73 84.04,57.24 80.61,57.24 80.1,57.75 80.1,60.03 85.05,64.99 85.05,73.75 79.04,79.76 54.53,79.76 49.74,84.54 45.3,84.54 v1(43.4,86.45)
FSMC_A8: length 75.1
  Top Layer w0.3: v1(55.21,87.34) 55.2,87.35 U6.27 ; U7.54 94.8,49.75 91.26,49.75 89.92,51.09 89.92,52.88 86.32,56.47 v1(86.32,56.6)
  Bottom Layer w0.3: v1(55.21,87.34) 55.21,86.83 56.99,85.05 79.97,85.05 90.51,74.51 90.51,61.73 86.32,57.54 v1(86.32,56.6)
FSMC_A9: length 73.5
  Top Layer w0.3: U7.55 94.8,50.25 91.39,50.25 90.37,51.28 90.37,53.06 87.21,56.22 v1(87.21,56.6) ; U6.26 56,87.43 v1(56.1,87.34)
  Bottom Layer w0.3: v1(56.1,87.34) 57.75,85.69 80.09,85.69 91.02,74.76 91.02,61.18 87.21,57.37 v1(87.21,56.6)
FSMC_A10: length 72.1
  Top Layer w0.3: v1(88.1,56.6) 88.1,56.1 90.82,53.37 90.82,51.46 91.54,50.75 U7.56 ; U6.25 56.8,87.65 v1(57.11,87.34)
  Bottom Layer w0.3: v1(57.11,87.34) 58,86.45 80.09,86.45 91.53,75.01 91.53,60.8 88.1,57.37 v1(88.1,56.6)
FSMC_A11: length 70.5
  Top Layer w0.3: U7.57 91.68,51.25 91.28,51.65 91.28,54.32 v1(88.99,56.6) ; v1(58.38,87.34) 57.6,88.12 U6.24
  Bottom Layer w0.3: v1(88.99,56.6) 88.99,57.24 92.04,60.29 92.04,75.15 79.85,87.34 v1(58.38,87.34)
FSMC_A12: length 43
  Top Layer w0.3: U7.87 85.75,65.05 84.8,66 84.8,74.89 83.7,76 59.18,76 58.38,76.8 58.38,78.11 U6.22
FSMC_A13: length 43.1
  Top Layer w0.3: U6.21 57.6,76.82 58.87,75.54 83.39,75.54 84.29,74.64 84.29,65.87 85.25,64.91 U7.88
FSMC_A14: length 43.3
  Top Layer w0.3: U7.89 84.75,64.77 83.84,65.68 83.84,74.33 83.08,75.09 58.44,75.09 56.8,76.73 U6.20
FSMC_A15: length 43.6
  Top Layer w0.3: U6.19 56,76.64 58,74.64 82.89,74.64 83.39,74.14 83.39,65.38 84.25,64.52 U7.90
FSMC_A16: length 82.7
  Top Layer w0.3: v1(69.56,94.96) 70.19,94.96 71.84,93.31 71.84,83.66 68.92,80.73 55.84,80.73 55.2,80.09 U6.18 ; v1(89.5,80.1) 89.25,79.85 U7.80
  Bottom Layer w0.3: v1(89.5,80.1) 89.5,87.71 82.25,94.96 v1(69.56,94.96)
FSMC_A17: length 63.5
  Top Layer w0.3: v1(62.83,94.07) 60.29,94.07 58.38,92.16 58.38,89.46 U6.23 ; U7.81 88.75,80.5 v1(88.86,80.61)
  Bottom Layer w0.3: v1(62.83,94.07) 82.39,94.07 88.86,87.59 v1(88.86,80.61)
FSMC_A18: length 65.8
  Top Layer w0.3: U7.82 88.25,69.92 87.85,70.32 87.85,81.12 v1(88.1,81.37) ; U6.28 54.4,91.23 v1(55.46,92.29)
  Bottom Layer w0.3: v1(55.46,92.29) 56.48,93.31 82.49,93.31 88.1,87.7 v1(88.1,81.37)
FSMC_D0: length 77.9
  Top Layer w0.3: U7.85 86.75,65.7 85.81,66.64 85.81,72.48 86.32,72.99 v1(86.32,82.89) ; U6.7 46.4,81.58 46.95,82.13 60.41,82.13 70.7,92.42 v1(71.08,92.42)
  Bottom Layer w0.3: v1(86.32,82.89) 86.32,88.74 82.64,92.42 v1(71.08,92.42)
FSMC_D1: length 75
  Top Layer w0.3: U7.86 86.25,65.44 85.31,66.38 v1(85.31,83.02) ; v1(71.08,91.53) 61.18,81.62 47.71,81.62 47.2,81.11 U6.8
  Bottom Layer w0.3: v1(85.31,83.02) 85.31,88.99 82.77,91.53 v1(71.08,91.53)
FSMC_D2: length 56.4
  Top Layer w0.3: v1(71.21,56.48) 71.44,56.25 U7.114 ; v1(49.75,79.85) 49.75,80.86 49.49,81.12 48.35,81.12 48,80.77 U6.9
  Bottom Layer w0.3: v1(49.75,79.85) 49.24,79.85 45.56,76.16 45.56,73.62 48.98,70.19 70.45,70.19 71.29,69.35 71.29,56.56 v1(71.21,56.48)
FSMC_D3: length 51.5
  Top Layer w0.3: v1(70.19,56.35) 70.19,56.1 70.54,55.75 U7.115 ; U6.10 48.8,80.17 v1(49.11,80.48)
  Bottom Layer w0.3: v1(70.19,56.35) 70.19,56.48 70.83,57.11 70.83,62.57 69.56,63.84 65.88,63.84 60,69.72 48.73,69.72 44.92,73.52 44.92,76.29 v1(49.11,80.48)
FSMC_D4: length 67.7
  Top Layer w0.3: v1(51.14,75.78) 51.2,75.84 U6.13 ; v1(92.16,51.91) 92.54,51.91 92.69,51.75 U7.58
  Bottom Layer w0.3: v1(51.14,75.78) 52.23,74.69 77.12,74.69 79.21,72.61 79.21,62.83 77.43,61.05 77.43,56.87 79.73,54.57 88.48,54.57 91.15,51.91 v1(92.16,51.91)
FSMC_D5: length 66.8
  Top Layer w0.3: U7.59 92.96,52.25 92.55,52.67 v1(92.42,52.67) ; v1(52.03,75.91) 52,75.94 U6.14
  Bottom Layer w0.3: v1(52.03,75.91) 52.79,75.15 77.81,75.15 79.85,73.11 79.85,62.7 77.94,60.8 77.94,57.15 80.03,55.06 88.75,55.06 91.15,52.67 v1(92.42,52.67)
FSMC_D6: length 66.2
  Top Layer w0.3: v1(92.42,53.56) 92.55,53.56 93.35,52.75 U7.60 ; U6.15 52.8,76.54 v1(52.92,76.42)
  Bottom Layer w0.3: v1(52.92,76.42) 53.68,75.65 78.96,75.65 80.48,74.13 80.48,62.57 78.45,60.54 78.45,57.29 80.23,55.52 89.06,55.52 91.02,53.56 v1(92.42,53.56)
FSMC_D7: length 65
  Top Layer w0.3: v1(53.94,76.42) 53.6,76.75 U6.16 ; v1(93.18,54.06) 93.37,54.25 U7.63
  Bottom Layer w0.3: v1(93.18,54.06) 91.28,55.97 80.41,55.97 79.08,57.3 79.08,60.41 80.99,62.32 80.99,74.38 78.7,76.67 54.19,76.67 v1(53.94,76.42)
FSMC_D8: length 74.3
  Top Layer w0.3: U6.29 53.6,87.55 v1(53.81,87.34) ; v1(85.43,56.6) 86.11,57.28 89.31,57.28 91.84,54.75 U7.64
  Bottom Layer w0.3: v1(53.81,87.34) 53.81,87.08 56.48,84.42 79.97,84.42 90.01,74.38 90.01,62.45 85.43,57.87 v1(85.43,56.6)
FSMC_D9: length 74.3
  Top Layer w0.3: U6.30 52.79,89.43 v1(52.79,87.34) ; U7.65 91.98,55.25 89.5,57.73 85.04,57.73 v1(84.8,57.49)
  Bottom Layer w0.3: v1(84.8,57.49) 84.8,58.38 89.5,63.08 89.5,74.25 80.09,83.66 56.09,83.66 53.36,86.39 53.36,86.39 52.79,86.96 v1(52.79,87.34)
FSMC_D10: length 74.8
  Top Layer w0.3: v1(52.03,87.47) 52,87.5 U6.31 ; U7.66 92.12,55.75 89.61,58.26 84.29,58.26 v1(84.04,58)
  Bottom Layer w0.3: v1(84.04,58) 84.04,58.38 88.86,63.21 88.86,74.24 80.08,83.02 55.85,83.02 52.03,86.84 v1(52.03,87.47)
FSMC_D11: length 75.2
  Top Layer w0.3: U7.67 92.26,56.25 89.75,58.76 83.66,58.76 v1(83.4,58.51) ; v1(51.27,86.96) 51.2,87.03 U6.32
  Bottom Layer w0.3: v1(83.4,58.51) 83.4,59.04 88.35,63.99 88.35,74.11 80.08,82.39 55.72,82.39 51.27,86.84 v1(51.27,86.96)
FSMC_D12: length 76.7
  Top Layer w0.3: v1(82.77,59.02) 83.02,59.27 89.88,59.27 92.4,56.75 U7.68 ; v1(49.24,87.21) 48.8,87.65 U6.35
  Bottom Layer w0.3: v1(82.77,59.02) 82.77,59.27 87.85,64.35 87.85,73.88 80.1,81.62 55.46,81.62 49.87,87.21 v1(49.24,87.21)
FSMC_D13: length 86.3
  Top Layer w0.3: v1(44.67,93.43) 46.57,93.43 48,92.01 U6.36 ; v1(91.78,78.19) 90.75,77.16 U7.77
  Bottom Layer w0.3: v1(91.78,78.19) 91.78,87.47 82,97.24 57.62,97.24 53.81,93.43 v1(44.67,93.43)
FSMC_D14: length 82.3
  Top Layer w0.3: U6.37 47.2,91.92 46.32,92.8 v1(45.56,92.8) ; U7.78 90.25,78.06 v1(91.02,78.83)
  Bottom Layer w0.3: v1(91.02,78.83) 91.02,87.47 81.88,96.61 57.87,96.61 54.06,92.8 v1(45.56,92.8)
FSMC_D15: length 79.2
  Top Layer w0.3: U6.38 46.4,91.57 v1(45.94,92.04) ; v1(90.26,79.59) 89.75,79.08 U7.79
  Bottom Layer w0.3: v1(45.94,92.04) 53.94,92.04 57.87,95.97 81.87,95.97 90.26,87.59 v1(90.26,79.59)
FSMC_NBL0: length 89.7
  Top Layer w0.3: v1(82.13,58.51) 82.13,58.13 80.99,56.99 80.99,44.41 78.19,41.62 75.91,41.62 74.78,42.75 U7.141 ; U6.39 45.6,88.18 46.44,87.34 v1(46.95,87.34)
  Bottom Layer w0.3: v1(82.13,58.51) 82,58.64 82,59.47 86.45,63.91 86.45,74.63 79.97,81.12 55.21,81.12 50.38,85.94 48.35,85.94 v1(46.95,87.34)
FSMC_NBL1: length 92.4
  Top Layer w0.3: v1(82.77,57.87) 82.64,57.87 81.5,56.73 81.5,44.16 78.45,41.11 75.65,41.11 74.51,42.25 U7.142 ; U6.40 44.8,87.71 45.94,86.58 v1(46.32,86.58)
  Bottom Layer w0.3: v1(46.32,86.58) 47.4,85.49 50.19,85.49 55.02,80.66 79.66,80.66 86,74.33 86,64.4 81.49,59.9 81.49,58.13 81.88,57.75 82.64,57.75 v1(82.77,57.87)
FSMC_NE3: length 59.4
  Top Layer w0.3: U6.6 45.6,77.26 45.81,77.05 47.84,77.05 48.73,76.16 48.73,73.88 46.19,71.34 45.17,71.34 44.55,70.71 R10.1 43.4,71.21 v1(42.13,71.21) ; v1(67.91,50.64) 68.02,50.75 U7.125
  Bottom Layer w0.3: v1(42.13,71.21) 43.4,71.21 47.71,66.89 58.51,66.89 66,59.4 66,52.79 67.91,50.89 v1(67.91,50.64)
FSMC_NOE: length 76.5
  Top Layer w0.3: U6.41 44,87.12 v1(44.67,86.45) ; U7.118 77.24,54.25 v1(80.86,57.87)
  Bottom Layer w0.3: v1(80.86,57.87) 80.86,60.03 85.54,64.72 85.54,74.02 79.35,80.21 54.72,80.21 49.89,85.04 46.08,85.04 v1(44.67,86.45)
FSMC_NWE: length 48
  Top Layer w0.3: U7.119 71.9,53.75 71.72,53.94 v1(71.72,55.08) ; U6.17 54.4,77.1 54.95,76.54 54.95,74.77 51.02,70.83 v1(50.89,70.83)
  Bottom Layer w0.254: v1(50.89,70.83) 70.57,70.83 71.84,69.56 71.84,55.21 v1(71.72,55.08)
KEY_ON: length 77
  Top Layer w0.3: v1(60.8,56.48) 60.29,55.97 39.46,55.97 28.79,66.64 25.87,66.64 25.12,67.39 R3.1 ; v1(75.78,44.41) 75.78,44.03 75,43.25 U7.140
  Top Layer w0.5: R3.1 25.08,68 Q2.3
  CPU2 w0.3: v1(60.8,56.48) 62.57,58.26 75.4,58.26 77.18,56.48 77.18,45.81 v1(75.78,44.41)
L_IN: length 156.4
  Top Layer w0.3: v1(78.07,42.38) 78.07,46.19 77.51,46.75 U7.133
  CPU1 w0.3: v1(57.11,98.13) 57.11,96.1 81.12,72.1 90.77,72.1 93.69,69.18 93.69,59.91 91.78,58 91.78,55.08 89.24,52.54 82.96,52.54 79.85,49.42 79.85,44.16 v1(78.07,42.38)
  Bottom Layer w0.3: CN1.3 42.76,95.21 49.37,95.21 52.41,98.26 56.99,98.26 v1(57.11,98.13) ; CN2.3 81.37,3.01 77.69,6.69 77.69,14.69 79.59,16.6 79.59,36.03 78.07,37.55 v1(78.07,42.38)
L_RCK: length 156.7
  Top Layer w0.3: U7.134 76.99,46.25 77.31,45.94 v1(77.31,42.25)
  CPU1 w0.3: v1(77.31,42.25) 77.31,42.63 79.21,44.54 79.21,50 82.39,53.18 89.12,53.18 91.02,55.08 91.02,58 93.18,60.16 93.18,68.92 90.51,71.59 80.86,71.59 55.84,96.61 v1(55.84,97.5)
  Bottom Layer w0.3: v1(77.31,42.25) 77.31,37.43 79.03,35.7 79.03,16.79 77.05,14.82 77.05,6.31 79,4.37 CN2.2 ; CN1.2 38.36,95.93 39.59,94.7 49.62,94.7 52.41,97.5 v1(55.84,97.5)
L_SCK: length 154.8
  Top Layer w0.3: v1(76.54,42.25) 76.54,45.56 76.35,45.75 U7.135
  CPU1 w0.3: CN1.1 35.86,97.2 37.17,98.51 53.18,98.51 80.61,71.08 90.13,71.08 92.55,68.67 92.55,60.41 90.39,58.26 90.39,55.33 88.74,53.68 81.32,53.68 78.7,51.06 78.7,44.92 76.54,42.76 v1(76.54,42.25)
  Bottom Layer w0.3: v1(76.54,42.25) 76.54,37.3 78.58,35.27 78.58,16.98 76.42,14.82 76.42,3.09 CN2.1
LED_1: length 64.7
  Top Layer w0.3: U7.19 84.25,40.82 85.94,42.51 85.94,45.56 86.32,45.94 v1(86.96,45.94)
  Bottom Layer w0.3: LED2.2 46.79,61.94 61.94,61.94 64.99,58.89 64.99,51.86 70.91,45.94 v1(86.96,45.94)
LED_2: length 64.3
  Top Layer w0.3: v1(86.96,45.17) 86.45,44.67 86.45,42.38 84.75,40.68 U7.20
  Bottom Layer w0.3: v1(86.96,45.17) 70.96,45.17 64.48,51.66 64.48,58.64 61.81,61.3 47.84,61.3 42.85,56.31 LED3.2
LED_PWR: length 68.1
  Top Layer w0.3: U7.18 83.75,40.96 85.43,42.64 85.43,46.32 85.94,46.83 v1(86.96,46.83)
  Bottom Layer w0.3: LED1.2 42.85,65.28 43.78,64.35 60.29,64.35 65.49,59.14 65.49,52.11 70.78,46.83 v1(86.96,46.83)
MCU_RX1: length 177.4
  Top Layer w0.3: v1(39.08,12.54) 39.08,7.33 U15.1 ; v1(77.56,65.11) 78.07,65.11 78.25,64.93 U7.102
  CPU2 w0.3: v1(77.56,65.11) 77.56,65.37 77.31,65.62 71.59,65.62 70.07,64.1 36.41,64.1 31.53,59.22 17.43,59.22 4.15,45.94 4.15,13.17 8.6,8.73 16.47,8.73 19.01,11.27 19.01,17.74 20.03,18.76 27.52,18.76 28.79,17.49 35.14,17.49 39.08,13.55 v1(39.08,12.54)
MCU_RX2: length 99.1
  Top Layer w0.3: U9.11 33.24,79.97 33.73,79.48 33.73,77.19 39.08,71.84 45.81,71.84 v1(47.08,73.11) ; v1(95.21,40.22) 95.85,40.22 96.1,40.48 96.1,40.98 95.83,41.25 U7.37
  Bottom Layer w0.3: v1(47.08,73.11) 48.1,73.11 49.68,71.53 73.3,71.53 74.89,69.94 74.89,68.16 72.99,66.26 72.99,55.9 77.9,50.99 82.54,50.99 85.94,47.59 92.29,47.59 95.21,44.67 v1(95.21,40.22)
MCU_RX3: length 38.6
  Top Layer w0.3: v1(92.93,58.26) 93.05,58.26 93.56,57.75 U7.70 ; v1(92.55,77.31) 92.55,79.72 88.48,83.78 83.53,83.78 82.5,82.75 82.5,80
  Bottom Layer w0.3: v1(92.55,77.31) 92.55,58.64 v1(92.93,58.26)
MCU_TX1: length 187.1
  Top Layer w0.3: U15.2 34.25,5.93 36.79,8.47 v1(36.79,10.76) ; v1(77.56,66.26) 77.81,66.26 78.75,65.32 U7.101
  CPU2 w0.3: v1(77.56,66.26) 77.56,67.91 76.8,68.67 73.24,68.67 69.12,64.55 41.06,64.55 38.19,67.42 38.19,71.34 36.67,72.86 20.41,72.86 3.65,56.1 3.65,12.92 8.47,8.09 17.36,8.09 22.7,13.42 36.28,13.42 36.79,12.92 v1(36.79,10.76)
MCU_TX2: length 104.8
  Top Layer w0.3: v1(95.97,38.82) 95.97,38.32 95.34,37.68 93.05,37.68 92.75,37.98 U7.36 ; v1(46.44,73.62) 46.06,73.62 44.74,72.3 39.39,72.3 34.18,77.5 34.18,80.55 33.49,81.24 U9.12
  Bottom Layer w0.3: v1(95.97,38.82) 95.97,44.54 92.48,48.04 86.25,48.04 82.85,51.44 78.19,51.44 73.66,55.97 73.66,66.04 75.53,67.91 75.53,70.19 73.74,71.98 49.87,71.98 48.1,73.75 46.57,73.75 v1(46.44,73.62)
MCU_TX3: length 44.1
  Top Layer w0.3: v1(93.43,76.67) 93.43,79.59 88.48,84.54 82.26,84.54 80.5,82.79 80.5,80 ; v1(92.67,57.49) 92.8,57.49 93.04,57.25 U7.69
  Bottom Layer w0.3: v1(92.67,57.49) 93.18,57.49 94.2,58.51 94.2,75.91 v1(93.43,76.67)
NRST: length 54.4
  Top Layer w0.3: SW2.2 91.65,29.04 v1(91.28,28.66) 91.53,28.41 91.53,20.92 88.74,18.12 v1(77.56,18.12) ; SW2.2 92.6,22.44 92.6,21.3 C49.2 ; SW2.2 94.32,29.04 96.49,31.21 R26.2 ; v1(86.58,36.28) 87.25,36.96 U7.25
  Bottom Layer w0.3: v1(86.58,36.28) 85.43,35.14 85.43,31.71 88.48,28.66 v1(91.28,28.66)
OSC32_IN: length 16.2
  Top Layer w0.3: U7.8 78.75,28.69 Y1.2 76.56,24.49 C5.2
OSC32_OUT: length 15.2
  Top Layer w0.3: C6.2 79.06,24.14 Y1.1 79.25,26.69 U7.9
OSC_IN: length 17.9
  Top Layer w0.3: C7.1 84.86,25.12 Y2.2 84.93,25.92 84.93,36.16 86.25,37.49 U7.23
OSC_OUT: length 19.1
  Top Layer w0.3: U7.24 86.75,37.35 85.43,36.03 85.43,31.08 88.59,27.92 Y2.1 88.03,24.93 C22.1
OV_PWDN: length 59.9
  Top Layer w0.3: v1(64.1,49.87) 65.47,51.25 U7.124 ; v1(52.41,23.71) 50.38,23.71 47.75,21.08 47.75,13.81
  Bottom Layer w0.3: v1(52.41,23.71) 52.41,23.84 52.92,24.35 63.46,24.35 63.84,24.73 63.84,49.62 v1(64.1,49.87)
OV_RESET: length 56.8
  Top Layer w0.3: 46.75,13.81 46.75,21.48 50.04,24.77 63.25,24.77 64.1,25.62 64.1,46.06 65.28,47.25 U7.132
OV_SCL: length 82.5
  Top Layer w0.3: v1(63.08,56.35) 65.62,56.35 69.72,52.25 U7.122 ; R8.1 46.25,4.46 46.25,21.99 v1(48.6,24.35)
  CPU1 w0.3: v1(63.08,56.35) 64.48,56.35 65.24,55.59 65.24,45.81 64.48,45.05 64.48,25.49 63.34,24.35 v1(48.6,24.35)
OV_SDA: length 96.4
  Top Layer w0.3: U7.123 69.58,51.75 66.38,54.95 36.41,54.95 35.78,54.32 35.78,27.65 40.6,22.82 43.9,22.82 45.25,21.48 45.25,7.27 42.38,4.4 R9.1
OV_XCLK: length 142.2
  Top Layer w0.3: U7.100 79.25,65.56 78.12,66.69 78.12,71.41 77.38,72.15 60.6,72.15 50.89,62.45 v1(50.89,58) ; v1(50,20.28) 50.25,20.04 50.25,4.16 51.88,2.53 U2.3
  CPU2 w0.3: v1(50.89,58) 57.24,58 59.65,55.59 64.99,55.59 67.15,53.43 67.15,50.76 64.73,48.35 64.73,21.94 62.57,19.77 50.51,19.77 v1(50,20.28)
PWR_EN: length 67.6
  Top Layer w0.3: v1(61.94,56.35) 61.05,55.46 34.63,55.46 28.88,49.71 D2.2 ; v1(74.89,44.54) 74.89,44.03 74.61,43.75 U7.139
  CPU2 w0.3: v1(74.89,44.54) 76.54,46.19 76.54,55.97 74.77,57.75 63.34,57.75 v1(61.94,56.35)
SW_EN: length 30.1
  Top Layer w0.5: v2(20.41,41.75) 19.35,42.8 R5.2 20.34,43.2 20.92,43.78 20.92,45.17 20.44,45.65 U4.1 ; v2(29.81,54.19) 27.48,54.19 26.89,53.6 26.63,53.6 D1.1
  Bottom Layer w0.5: v2(29.81,54.19) 29.81,51.14 v2(20.41,41.75)
SWCLK: length 143.6
  Top Layer w0.3: U7.109 69.57,58.75 v1(69.18,59.14)
  CPU2 w0.3: v1(69.18,59.14) 68.03,59.14 64.1,63.08 36.91,63.08 29.75,55.91 15.91,55.91 8.47,48.48 8.47,39.59 14.38,33.68 16.67,33.68 22.81,27.54 22.81,26.65 23.77,25.69 23.77,24.42 24.6,23.58 29.93,23.58 34.89,18.63 36.28,18.63 41.36,13.55 41.36,9.52 38.92,7.07 32.98,7.07 31.25,5.34 U15.4
SWDIO: length 153.2
  Top Layer w0.3: U7.105 76.75,63.67 v1(76.92,63.84)
  CPU2 w0.3: 29.74,4.03 29.74,5.74 31.84,7.84 38.65,7.84 40.73,9.91 40.73,13.17 35.78,18.12 29.17,18.12 27.39,19.9 23.08,19.9 21.43,21.55 21.43,25.87 ; 21.43,25.89 21.41,25.88 21.43,25.87 ; 21.43,25.89 21.43,27.9 16.18,33.15 14.15,33.15 7.58,39.71 7.58,48.48 17.87,58.76 31.96,58.76 36.78,63.59 76.67,63.59 v1(76.92,63.84) ; 21.43,25.89 21.43,25.87
USB+: length 137.7
  Top Layer w0.5: R25.2 14.69,14.76 11.91,11.97
  Top Layer w0.7: 14.26,11.19 14.19,11.11 14.19,7.58 15.2,6.57 U13.5 ; C46.2 11.91,11.97 U12.4 ; U13.2 18.8,5.64 15.62,8.82 15.43,8.82
  Top Layer w1: 15.43,8.82 15.43,10.02 13.49,11.97 C46.2
  Bottom Layer w0.5: R15.2 57.36,6.69 49.37,6.69 47.71,5.04 43.27,5.04 39.46,8.85 17.74,8.85 16.73,9.87 14.77,9.87 14.67,9.77
  Bottom Layer w0.7: 14.82,9.61 14.82,7.71 15.2,7.33 U13.5 ; 15.43,9 18.8,5.64 U13.2
  Bottom Layer w1: 15.43,9 7.58,16.85 7.58,22.57 8.99,23.97 R14.2 15.34,22.7 18.76,22.7 20,23.94 D3.2
$1N11070: length 9.8
  Top Layer w0.5: U2.4 66.41,2.53 ; 66.41,2.53 69.47,2.53 C1.2 ; 66.41,2.53 70.07,6.19 L1.1
$1N20605: length 29.3
  Top Layer w0.3: C32.2 93.7,31.22 93.31,30.82 91.02,30.82 R12.1 ; C32.2 94.96,32.09 v1(95.21,31.84) ; C32.2 94.96,33.35 94.96,34.76 94.02,35.7 C30.2 ; 91.2,35.7 C30.2 ; C30.2 91.25,35.95 U7.33 ; U7.32 90.75,36.9 89.5,35.65 89.5,35.14 90.13,35.14 v1(90.51,35.52)
  Bottom Layer w0.3: v1(90.51,35.52) 91.53,35.52 v1(95.21,31.84)
$1N21732: length 3.5
  Top Layer w0.3: C45.2 97.56,59.59 96.22,58.25 U7.71
$1N22015: length 4.2
  Top Layer w0.3: U7.106 76.25,64.67 C39.2
$1N22293: length 3.4
  Top Layer w0.3: R11.2 71.17,44.25 U7.138
$1N22641: length 3.1
  Top Layer w0.3: R13.1 97.44,46.75 U7.48
$1N49914: length 3.3
  Top Layer w0.5: U12.2 9.37,13.68 7.96,12.27 R29.2
$1N58921: length 2
  Bottom Layer w0.5: LED1.1 41.25,68.1 41.25,70
$1N63388: length 2
  Bottom Layer w0.5: 41.25,60 41.25,58.1 LED2.1
$1N63497: length 2.7
  Bottom Layer w0.5: LED3.1 38.75,55.8 R24.1
$1N121900: length 8.5
  Top Layer w0.5: L3.1 27.01,23.4 C26.2 C27.2 24.66,23.08 U8.2
$1N139219: length 5.9
  Bottom Layer w1: R14.1 14.06,26.41 Q3.1 16.15,28.51 R17.2
$1N139221: length 4.8
  Bottom Layer w0.5: Q5.1 10.25,34.85 R16.1
$1N139226: length 3.3
  Bottom Layer w1: CN4.1 10.25,31.5 Q5.3
$1N141101: length 9.6
  Top Layer w0.7: L2.1 23.84,41.49 23.84,45.55 21.84,47.55 U4.3
$1N141104: length 20
  Top Layer w0.5: R6.2 27.54,36.04 R1.1 25.42,35.96 C3.2 19.46,35.96 15.96,39.46 15.96,44.54 17.08,45.65 U4.5
$1N161989: length 15.9
  Top Layer w0.5: 26.63,61.73 26.58,61.68 R7.1 23.97,63.54 SW1.2 ; SW1.1 22.75,70.85 Q2.1
  Bottom Layer w0.5: SW1.1 SW1.2
$1N166238: length 9
  Top Layer w0.5: U10.2 25.93,12.15 25.49,11.71 27.9,11.71 28.16,11.97 L4.1
$1N167422: length 13.2
  Top Layer w0.5: U11.2 82.9,11.45 C41.2 C40.2 84.36,12.41 82.42,12.41 L5.1

## Copper pours and planes (outline as drawn; the poured copper is in the pictures)
GND on Top Layer: -2.58,102.2 101.82,102.2 101.82,-1.56 -2.58,-1.56
GND on Bottom Layer: -2.58,102.2 101.82,102.2 101.82,-1.56 -2.58,-1.56
